# Altium project Smart104.ua_V2_rev2.PrjPcb
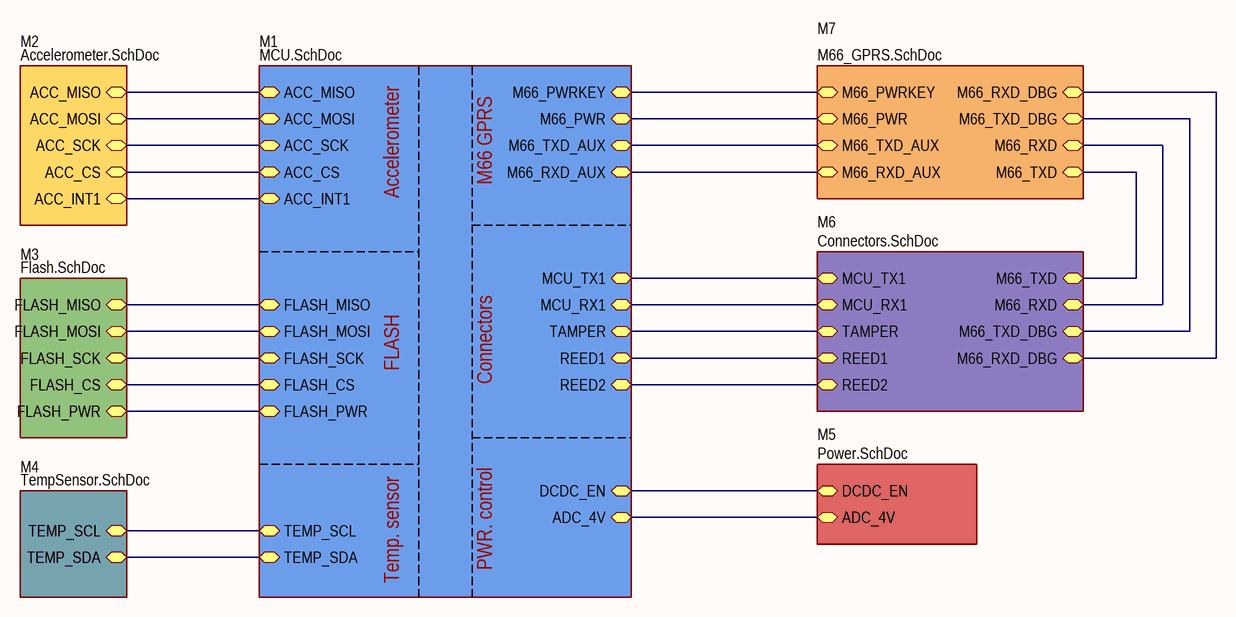
[diagram p0: TopLevelSCH.SchDoc]
8 sheets, 158 parts. Net scope: hierarchical (ports join the sheet entries above them; power ports are global).
Board file: Smart104.ua_V2_rev2.PcbDoc
Sheets:
  TopLevelSCH.SchDoc
    M1 = MCU.SchDoc
    M2 = Accelerometer.SchDoc
    M3 = Flash.SchDoc
    M4 = TempSensor.SchDoc
    M5 = Power.SchDoc
    M6 = Connectors.SchDoc
    M7 = M66_GPRS.SchDoc

## Sheet TopLevelSCH.SchDoc
size 420 x 297 mm

### Sub-sheets
M1 = MCU.SchDoc: DCDC_EN (bidir), REED2 (bidir), REED1 (bidir), MCU_TX1 (bidir), TAMPER (bidir), MCU_RX1 (bidir), TEMP_SDA (bidir), TEMP_SCL (bidir), ACC_INT1 (bidir), ACC_MOSI (bidir), ACC_MISO (bidir), ACC_SCK (bidir), ACC_CS (bidir), FLASH_PWR (bidir), FLASH_CS (bidir), FLASH_SCK (bidir), FLASH_MOSI (bidir), FLASH_MISO (bidir), ADC_4V (bidir), M66_PWRKEY (bidir), M66_PWR (bidir), M66_TXD_AUX (bidir), M66_RXD_AUX (bidir)
M2 = Accelerometer.SchDoc: ACC_INT1 (bidir), ACC_MOSI (bidir), ACC_MISO (bidir), ACC_SCK (bidir), ACC_CS (bidir)
M3 = Flash.SchDoc: FLASH_PWR (bidir), FLASH_CS (bidir), FLASH_SCK (bidir), FLASH_MOSI (bidir), FLASH_MISO (bidir)
M4 = TempSensor.SchDoc: TEMP_SDA (bidir), TEMP_SCL (bidir)
M5 = Power.SchDoc: ADC_4V (bidir), DCDC_EN (bidir)
M6 = Connectors.SchDoc: MCU_TX1 (bidir), MCU_RX1 (bidir), TAMPER (bidir), REED2 (bidir), REED1 (bidir), M66_TXD_DBG (bidir), M66_RXD_DBG (bidir), M66_RXD (bidir), M66_TXD (bidir)
M7 = M66_GPRS.SchDoc: M66_PWRKEY (bidir), M66_PWR (bidir), M66_TXD_DBG (bidir), M66_RXD_DBG (bidir), M66_RXD_AUX (bidir), M66_TXD_AUX (bidir), M66_RXD (bidir), M66_TXD (bidir)

### Nets
NetD1_5: sheet M1/ACC_INT1, sheet M2/ACC_INT1
NetD3_17: sheet M6/M66_RXD, sheet M7/M66_RXD
NetD3_18: sheet M6/M66_TXD, sheet M7/M66_TXD
NetD3_38: sheet M6/M66_RXD_DBG, sheet M7/M66_RXD_DBG
NetD3_39: sheet M6/M66_TXD_DBG, sheet M7/M66_TXD_DBG
NetD5_10: sheet M1/REED1, sheet M6/REED1
NetD5_12: sheet M1/M66_RXD_AUX, sheet M7/M66_RXD_AUX
NetD5_13: sheet M1/M66_TXD_AUX, sheet M7/M66_TXD_AUX
NetD5_14: sheet M1/ACC_CS, sheet M2/ACC_CS
NetD5_15: sheet M1/ACC_SCK, sheet M2/ACC_SCK
NetD5_16: sheet M1/ACC_MISO, sheet M2/ACC_MISO
NetD5_17: sheet M1/ACC_MOSI, sheet M2/ACC_MOSI
NetD5_19: sheet M1/ADC_4V, sheet M5/ADC_4V
NetD5_21: sheet M1/M66_PWRKEY, sheet M7/M66_PWRKEY
NetD5_22: sheet M1/M66_PWR, sheet M7/M66_PWR
NetD5_25: sheet M1/FLASH_CS, sheet M3/FLASH_CS
NetD5_26: sheet M1/FLASH_SCK, sheet M3/FLASH_SCK
NetD5_27: sheet M1/FLASH_MISO, sheet M3/FLASH_MISO
NetD5_28: sheet M1/FLASH_MOSI, sheet M3/FLASH_MOSI
NetD5_29: sheet M1/REED2, sheet M6/REED2
NetD5_30: sheet M1/MCU_TX1, sheet M6/MCU_TX1
NetD5_31: sheet M1/MCU_RX1, sheet M6/MCU_RX1
NetD5_41: sheet M1/TAMPER, sheet M6/TAMPER
NetD5_42: sheet M1/TEMP_SCL, sheet M4/TEMP_SCL
NetD5_43: sheet M1/TEMP_SDA, sheet M4/TEMP_SDA
NetD5_45: sheet M1/FLASH_PWR, sheet M3/FLASH_PWR
NetD5_46: sheet M1/DCDC_EN, sheet M5/DCDC_EN

### Notes on the sheet
- M66 GPRS
- Accelerometer
- FLASH
- Connectors
- Temp. sensor
- PWR. control
- Author
- Manufacturer
- Date
- Page
- Total pages
- Size page
- A3
- Materials

## Sheet MCU.SchDoc
size 420 x 297 mm
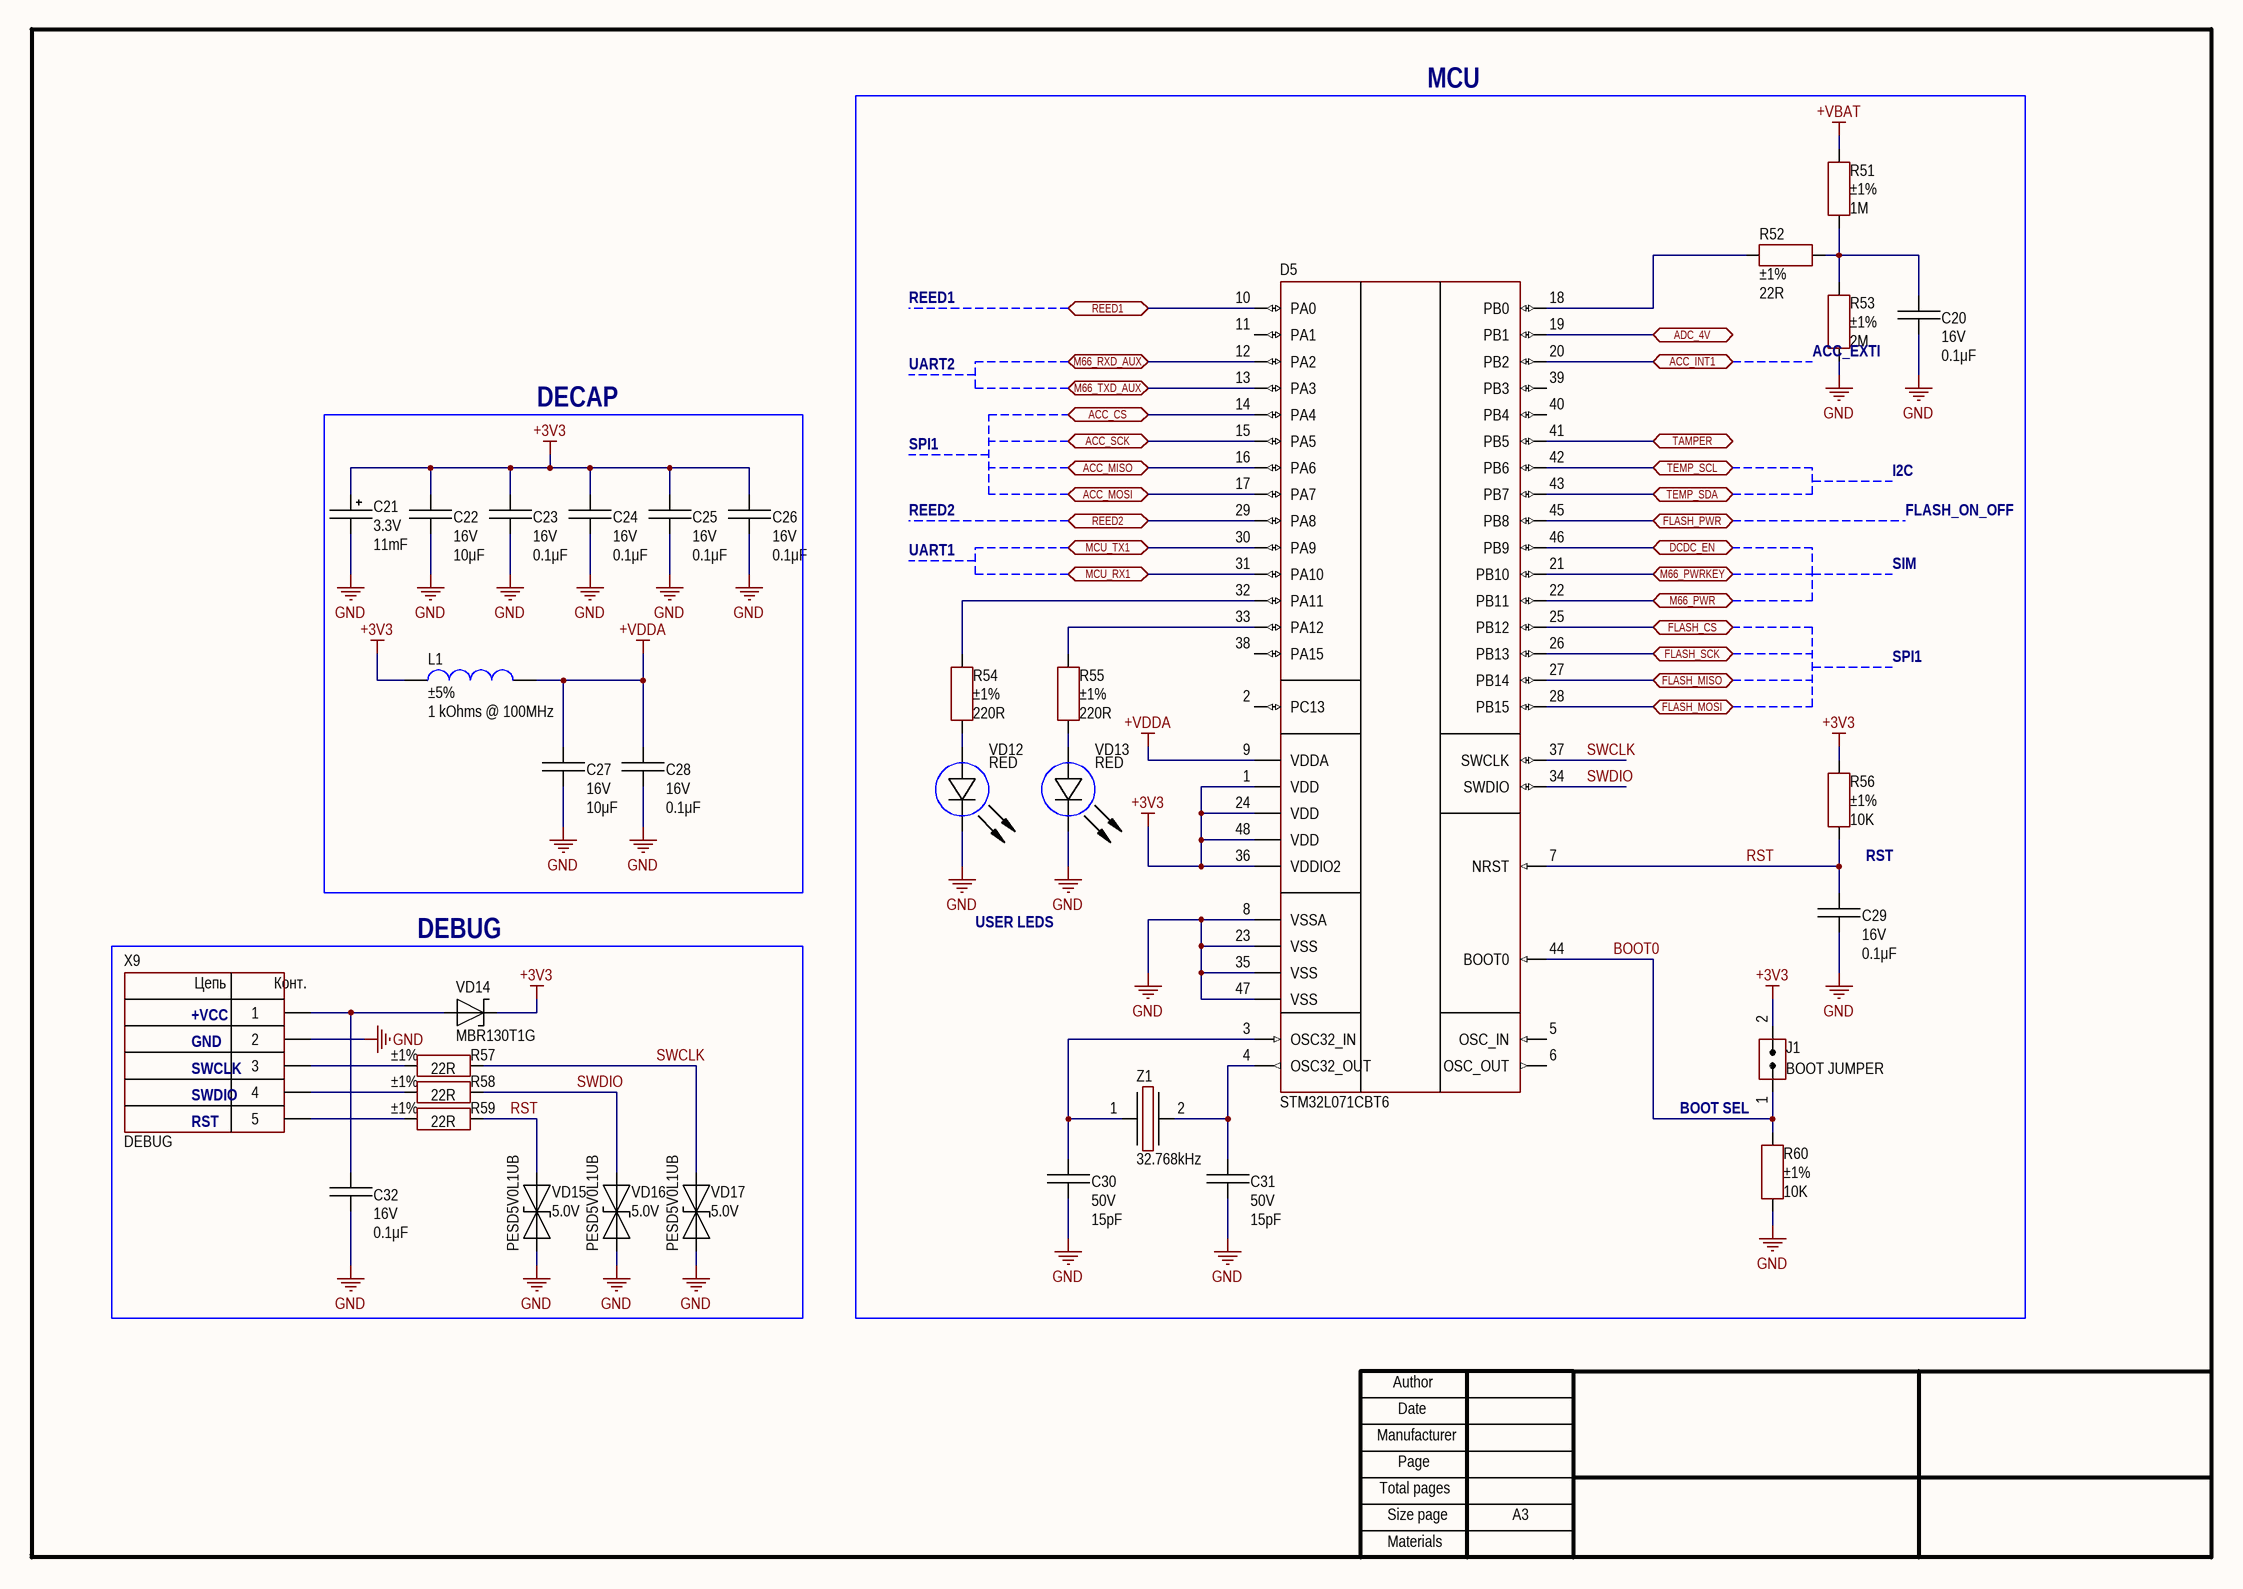
[diagram p1: MCU.SchDoc]

### Parts
C20  value 0.1μF  Voltage: 16V  [CAP: 0402]
C21  value 11mF  Voltage: 3.3V  [CAP: CPH3225A]
C22  value 10μF  Voltage: 16V  [CAP: 0805]
C23  value 0.1μF  Voltage: 16V  [CAP: 0402]
C24  value 0.1μF  Voltage: 16V  [CAP: 0402]
C25  value 0.1μF  Voltage: 16V  [CAP: 0402]
C26  value 0.1μF  Voltage: 16V  [CAP: 0402]
C27  value 10μF  Voltage: 16V  [CAP: 0805]
C28  value 0.1μF  Voltage: 16V  [CAP: 0402]
C29  value 0.1μF  Voltage: 16V  [CAP: 0402]
C30  value 15pF  Voltage: 50V  [CAP: 0402]
C31  value 15pF  Voltage: 50V  [CAP: 0402]
C32  value 0.1μF  Voltage: 16V  [CAP: 0402]
D5  PartNumber: STM32L071CBT6  [48-LQFP]
J1  CommentText: BOOT JUMPER  [CON: JUMPER x1]
L1  value 1 kOhms @ 100MHz  Tolerance: ±5%  [IND: 0402]
R51  value 1M  Tolerance: ±1%  [RES: 0402]
R52  value 22R  Tolerance: ±1%  [RES: 0402]
R53  value 2M  Tolerance: ±1%  [RES: 0402]
R54  value 220R  Tolerance: ±1%  [RES: 0402]
R55  value 220R  Tolerance: ±1%  [RES: 0402]
R56  value 10K  Tolerance: ±1%  [RES: 0402]
R57  value 22R  Tolerance: ±1%  [RES: 0402]
R58  value 22R  Tolerance: ±1%  [RES: 0402]
R59  value 22R  Tolerance: ±1%  [RES: 0402]
R60  value 10K  Tolerance: ±1%  [RES: 0402]
VD12  Color: RED  [LED: 0805R]
VD13  Color: RED  [LED: 0805R]
VD14  PartNumber: MBR130T1G  [DIODE: SOD123]
VD15  Voltage: 5.0V  PartNumber: PESD5V0L1UB  [DIODE: SOD523]
VD16  Voltage: 5.0V  PartNumber: PESD5V0L1UB  [DIODE: SOD523]
VD17  Voltage: 5.0V  PartNumber: PESD5V0L1UB  [DIODE: SOD523]
X9  CommentText: DEBUG  [CON: PLS-5]
Z1  Frequency: 32.768kHz  [OSC: 3215]

### Blocks framed on the sheet
MCU: C20 C29-C31 D5 J1 R51-R56 R60 VD12 VD13 Z1
DECAP: C21-C28 L1
DEBUG: C32 R57-R59 VD14-VD17 X9

### Ports
ACC_CS (bidir), ACC_INT1 (bidir), ACC_MISO (bidir), ACC_MOSI (bidir), ACC_SCK (bidir), ADC_4V (bidir), DCDC_EN (bidir), FLASH_CS (bidir), FLASH_MISO (bidir), FLASH_MOSI (bidir), FLASH_PWR (bidir), FLASH_SCK (bidir), M66_PWR (bidir), M66_PWRKEY (bidir), M66_RXD_AUX (bidir), M66_TXD_AUX (bidir), MCU_RX1 (bidir), MCU_TX1 (bidir), REED1 (bidir), REED2 (bidir), TAMPER (bidir), TEMP_SCL (bidir), TEMP_SDA (bidir)

### Nets
+3V3: C21.1 C22.2 C23.2 C24.2 C25.2 C26.2 D5.1(VDD) D5.24(VDD) D5.36(VDDIO2) D5.48(VDD) J1.2(IN) L1.2 R56.2 VD14.2
+VBAT: R51.2
+VDDA: C27.2 C28.2 D5.9(VDDA) L1.1
GND: C20.1 C21.2 C22.1 C23.1 C24.1 C25.1 C26.1 C27.1 C28.1 C29.1 C30.1 C31.1 C32.1 D5.8(VSSA) D5.23(VSS) D5.35(VSS) D5.47(VSS) R53.1 R60.1 VD12.2(C) VD13.2(C) VD15.1(A) VD16.1(A) VD17.1(A) X9.2
BOOT0: D5.44(BOOT0) J1.1(IN) R60.2
RST: C29.2 D5.7(NRST) R56.1 R59.2 VD15.2(C)
SWCLK: D5.37(SWCLK) R57.2 VD17.2(C)
SWDIO: D5.34(SWDIO) R58.2 VD16.2(C)
NetC20_2: C20.2 R51.1 R52.2 R53.2
NetC30_2: C30.2 D5.3(OSC32_IN) Z1.1
NetC31_2: C31.2 D5.4(OSC32_OUT) Z1.2
NetC32_2: C32.2 VD14.1 X9.1
NetD1_5: D5.20(PB2) ; port ACC_INT1
NetD5_10: D5.10(PA0) ; port REED1
NetD5_12: D5.12(PA2) ; port M66_RXD_AUX
NetD5_13: D5.13(PA3) ; port M66_TXD_AUX
NetD5_14: D5.14(PA4) ; port ACC_CS
NetD5_15: D5.15(PA5) ; port ACC_SCK
NetD5_16: D5.16(PA6) ; port ACC_MISO
NetD5_17: D5.17(PA7) ; port ACC_MOSI
NetD5_18: D5.18(PB0) R52.1
NetD5_19: D5.19(PB1) ; port ADC_4V
NetD5_21: D5.21(PB10) ; port M66_PWRKEY
NetD5_22: D5.22(PB11) ; port M66_PWR
NetD5_25: D5.25(PB12) ; port FLASH_CS
NetD5_26: D5.26(PB13) ; port FLASH_SCK
NetD5_27: D5.27(PB14) ; port FLASH_MISO
NetD5_28: D5.28(PB15) ; port FLASH_MOSI
NetD5_29: D5.29(PA8) ; port REED2
NetD5_30: D5.30(PA9) ; port MCU_TX1
NetD5_31: D5.31(PA10) ; port MCU_RX1
NetD5_32: D5.32(PA11) R54.2
NetD5_33: D5.33(PA12) R55.2
NetD5_41: D5.41(PB5) ; port TAMPER
NetD5_42: D5.42(PB6) ; port TEMP_SCL
NetD5_43: D5.43(PB7) ; port TEMP_SDA
NetD5_45: D5.45(PB8) ; port FLASH_PWR
NetD5_46: D5.46(PB9) ; port DCDC_EN
NetR54_1: R54.1 VD12.1(A)
NetR55_1: R55.1 VD13.1(A)
NetR57_1: R57.1 X9.3
NetR58_1: R58.1 X9.4
NetR59_1: R59.1 X9.5

Not connected (* = marked no-connect by the designer): D5 2(PC13) 5(OSC_IN) 6(OSC_OUT) 11(PA1) 38(PA15) 39(PB3) 40(PB4)

### Notes on the sheet
- REED1
- UART2
- (near R53) ACC_EXTI
- SPI1
- REED2
- I2C
- FLASH_ON_OFF
- UART1
- SIM
- RST
- USER LEDS
- +VCC
- GND
- SWCLK
- SWDIO
- BOOT SEL
- Author
- Manufacturer
- Date
- Page
- Total pages
- Size page
- A3
- Materials
- (in symbol PLS-5) Цепь; Конт.

### Library data of the parts
C20 C23-C26 C28 C29 C32 = Ceramic_0402: ±10% 16V Ceramic Capacitor X7R 0402 (1005 Metric); Manufacturer: Yageo; PartNumber: CC0402KRX7R7BB104; ValueManufacturerPartNumber: Ceramic capacitor, 0.1μF, X7R, ±10%, 16V, 0402, -55...+125°C; Package: 0402; HelpURL: https://www.digikey.com/product-detail/en/yageo/CC0402KRX7R7BB104/311-1338-1-ND/2103122; Temperature: -55...+125°C; TypeCapacitor: Ceramic capacitor; Tolerance: ±10%; TypeDielectric: X7R
C21 = CPH3225A: EDLC; Manufacturer: Seiko Instruments; PartNumber: F930J107KAAAJ6; ValueManufacturerPartNumber: EDLC, 11mF, 3.3V, ±10%, 160Ohm, 1210, -55...+125°C; Impedance: 160Ohm; Tolerance: ±10%; TypeDielectric: X7R; Package: 1210; HelpURL: https://www.digikey.com/en/products/detail/seiko-instruments/CPH3225A/8692444; Temperature: -55...+125°C; TypeCapacitor: EDLC
C22 C27 = Ceramic_0805: ±20% 16V Ceramic Capacitor X7R 0805 (2012 Metric); Manufacturer: Yageo; PartNumber: CC0805MKX7R7BB106; ValueManufacturerPartNumber: Ceramic capacitor, 10μF, X7R, ±10%, 16V, 0805, -55...+125°C; Tolerance: ±10%; Package: 0805; HelpURL: https://www.digikey.com/en/products/detail/yageo/CC0805MKX7R7BB106/7164392; Temperature: -55...+125°C; TypeCapacitor: Ceramic capacitor; TypeDielectric: X7R
C30 C31 = Ceramic_0402: ±5% 50V Ceramic Capacitor C0G, NP0 0402 (1005 Metric); Manufacturer: Yageo; PartNumber: CC0402JRNPO9BN150; ValueManufacturerPartNumber: Ceramic capacitor, 15pF, NP0, ±10%, 50V, 0402, -55...+125°C; Tolerance: ±10%; Package: 0402; HelpURL: https://www.digikey.com/en/products/detail/yageo/CC0402JRNPO9BN150/302751; Temperature: -55...+125°C; TypeCapacitor: Ceramic capacitor; TypeDielectric: NP0
D5 = STM32L071C8T6: ARM® Cortex®-M0+ series Microcontroller IC 32-Bit 32MHz 128KB (128K x 8) FLASH 48-LQFP (7x7); Manufacturer: STMicroelectronics; ValueManufacturerPartNumber: IC microcontroller, 32-Bit, Cortex-M0+, 32MHz, 128KB, 20KB, 1.65V...3.6V, -40...+85°C, 48-LQFP; Supply: 1.65V...3.6V; MemoryRAM: 20KB; CoreProcessor: Cortex-M0+; HelpURL: https://www.digikey.com/en/products/detail/stmicroelectronics/STM32L071CBT6/6166982; Package: 48-LQFP; ComponentType: IC microcontroller; Temperature: -40...+85°C; Speed: 32MHz; CoreSize: 32-Bit; MemoryROM: 128KB
J1 = Jumper_single
L1 = Inductor_0402: 100 nH Unshielded Multilayer Inductor 200 mA 1.25Ohm Max 0402 (1005 Metric); Manufacturer: Murata Electronics; PartNumber: LQG15HSR10J02D; ValueManufacturerPartNumber: Ferrite Bead, 1 kOhms @ 100MHz, ±5%, 0402, 200mA, -55...+125°C; TypeInductor: Ferrite Bead; MaxCurrent: 200mA; Package: 0402; HelpURL: https://www.digikey.com/product-detail/en/murata-electronics-north-america/LQG15HSR10J02D/490-2635-1-ND/662915; Temperature: -55...+125°C
R51 = Resistor_0402: 1 MOhms ±1% 0.063W, 1/16W Chip Resistor 0402 (1005 Metric) Moisture Resistant Thick Film; Manufacturer: Yageo; PartNumber: RC0402FR-071ML; ValueManufacturerPartNumber: Resistor film, 1M, ±1%, 0402, 0.063W, -55...+125°C; TypeResistor: Resistor film; Package: 0402; HelpURL: https://www.digikey.com/en/products/detail/yageo/RC0402FR-071ML/726515; Temperature: -55...+125°C; Power: 0.063W
R52 R57-R59 = Resistor_0402: 22 Ohms ±1% 0.063W, 1/16W Chip Resistor 0402 (1005 Metric) Moisture Resistant Thick Film; Manufacturer: Yageo; PartNumber: RC0402FR-0722RL; ValueManufacturerPartNumber: Resistor film, 22R, ±1%, 0402, 0.063W, -55...+125°C; TypeResistor: Resistor film; Package: 0402; HelpURL: https://www.digikey.com/en/products/detail/yageo/RC0402FR-0722RL/726562; Temperature: -55...+125°C; Power: 0.063W
R53 = Resistor_0402: 2 MOhms ±1% 0.063W, 1/16W Chip Resistor 0402 (1005 Metric) Moisture Resistant Thick Film; Manufacturer: Yageo; PartNumber: RC0402FR-072ML; ValueManufacturerPartNumber: Resistor film, 2M, ±1%, 0402, 0.063W, -55...+125°C; TypeResistor: Resistor film; Package: 0402; HelpURL: https://www.digikey.com/en/products/detail/yageo/RC0402FR-072ML/5917635; Temperature: -55...+125°C; Power: 0.063W
R54 R55 = Resistor_0402: 220 Ohms ±1% 0.063W, 1/16W Chip Resistor 0402 (1005 Metric) Moisture Resistant Thick Film; Manufacturer: Yageo; PartNumber: RC0402FR-07220RL; ValueManufacturerPartNumber: Resistor film, 220R, ±1%, 0402, 0.063W, -55...+125°C; TypeResistor: Resistor film; Package: 0402; HelpURL: https://www.digikey.com/en/products/detail/yageo/RC0402FR-07220RL/726565; Temperature: -55...+125°C; Power: 0.063W
R56 R60 = Resistor_0402: 10 kOhms ±1% 0.063W, 1/16W Chip Resistor 0402 (1005 Metric) Moisture Resistant Thick Film; Manufacturer: Yageo; PartNumber: RC0402FR-0710KL; ValueManufacturerPartNumber: Resistor film, 10K, ±1%, 0402, 0.063W, -55...+125°C; TypeResistor: Resistor film; Package: 0402; HelpURL: https://www.digikey.com/en/products/detail/yageo/RC0402FR-0710KL/726523; Temperature: -55...+125°C; Power: 0.063W
VD12 VD13 = LED_single: Red 625nm LED Indication - Discrete 1.8V 0805 (2012 Metric); Manufacturer: Kingbright; ValueManufacturerPartNumber: LED, RED, 30mA, 1.8V, 0805, -55...+150°C; PartNumber: APT2012LSECK/J3-PRV; Current: 30mA; Package: 0805; HelpURL: https://www.digikey.com/en/products/detail/kingbright/APT2012LSECK-J3-PRV/5177436; Temperature: -55...+150°C; TypeDiode: LED; VoltageDrop: 1.8V; ColorParameter: RED
VD14 = Schottky_single: Diode Schottky 30 V 1A Surface Mount SOD-123; Manufacturer: Diodes Incorporated; ValueManufacturerPartNumber: Schottky diode, 30V, 1A, 0.45V, 15pF, SOD-123, -55...+150°C; TypeDiode: Schottky diode; Voltage: 30V; VoltageDrop: 0.45V; RecoveryTime: 15pF; Package: SOD-123; HelpURL: https://www.digikey.com/en/products/detail/on-semiconductor/MBR130T1G/918582; Temperature: -55...+150°C; Current: 1A
VD15-VD17 = TVS_single: 12V Clamp 3.5A (8/20µs) Ipp Tvs Diode Surface Mount SOD-523; Manufacturer: Nexperia; TypeDiode: ESD TVS diode; Package: SOD-523; HelpURL: https://www.digikey.com/en/products/detail/nexperia-usa-inc/PESD5V0L1UB115/2092297; ValueManufacturerPartNumber: =TypeDiode+', '+Voltage+', '+Current+', '+VoltageDrop+', '+RecoveryTime+', '+Package+', '+Temperature; Temperature: -55...+150°C; Current: 3.5A
X9 = PLS-5: Pin Header 5 pin Straight, 2.54mm Through Hole.; Manufacturer: KLS; ValueManufacturerPartNumber: Connector, 5pin, 2.54mm, 500VAC, 0.1A; PartNumber: KLS1-207-1-05-S; TypeConnector: Connector; VoltageMax: 500VAC; CurrentMax: 0.1A; Multichannel: 5pin; HelpURL: https://www.klselectronic.com/kls1-207-2-54mm-pitch-male-pin-header-connectors; Pitch: 2.54mm
Z1 = Crystal_3215: 3215 ±20ppm Crystal 12.5pF 2-SMD, No Lead; Manufacturer: Epson; PartNumber: FC-135 32.7680KA-A5; ValueManufacturerPartNumber: Crystal, 32.768kHz, 12.5pF, ±20ppm, case 3215, -40...+85°C; Package: case 3215; HelpURL: https://www.digikey.com/product-detail/en/epson/FC-135-32.7680KA-A5/SER4103CT-ND/6188447; Temperature: -40...+85°C; TypeOscilator: Crystal; LoadCapacitance: 12.5pF; Tolerance: ±20ppm

## Sheet Accelerometer.SchDoc
size 420 x 297 mm
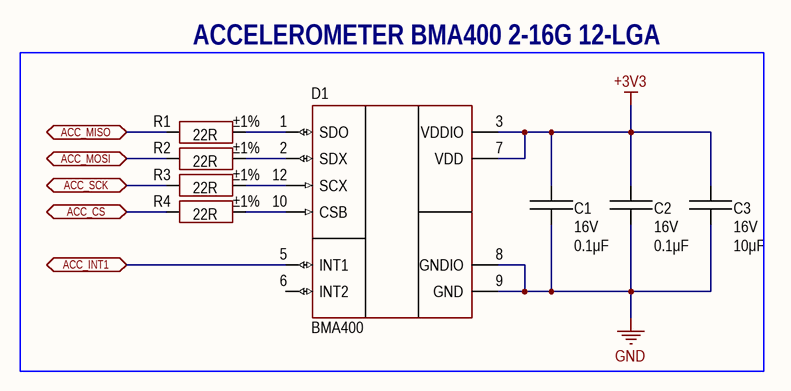
[diagram p2: Accelerometer.SchDoc]

### Parts
C1  value 0.1μF  Voltage: 16V  [CAP: 0402]
C2  value 0.1μF  Voltage: 16V  [CAP: 0402]
C3  value 10μF  Voltage: 16V  [CAP: 0805]
D1  (no value)  [12-VFLGA]
R1  value 22R  Tolerance: ±1%  [RES: 0402]
R2  value 22R  Tolerance: ±1%  [RES: 0402]
R3  value 22R  Tolerance: ±1%  [RES: 0402]
R4  value 22R  Tolerance: ±1%  [RES: 0402]

### Blocks framed on the sheet
ACCELEROMETER BMA400 2-16G 12-LGA: C1-C3 D1 R1-R4

### Ports
ACC_CS (bidir), ACC_INT1 (bidir), ACC_MISO (bidir), ACC_MOSI (bidir), ACC_SCK (bidir)

### Nets
+3V3: C1.2 C2.2 C3.2 D1.3(VDDIO) D1.7(VDD)
GND: C1.1 C2.1 C3.1 D1.8(GNDIO) D1.9(GND)
NetD1_1: D1.1(SDO) R1.2
NetD1_2: D1.2(SDX) R2.2
NetD1_5: D1.5(INT1) ; port ACC_INT1
NetD1_10: D1.10(CSB) R4.2
NetD1_12: D1.12(SCX) R3.2
NetD5_14: R4.1 ; port ACC_CS
NetD5_15: R3.1 ; port ACC_SCK
NetD5_16: R1.1 ; port ACC_MISO
NetD5_17: R2.1 ; port ACC_MOSI

Not connected (* = marked no-connect by the designer): D1 6(INT2)

### Notes on the sheet
- Author
- Manufacturer
- Date
- Page
- Total pages
- Size page
- A3
- Materials

### Library data of the parts
C1 C2 = Ceramic_0402: as C20 on sheet MCU; Package: 0402; HelpURL: https://www.digikey.com/product-detail/en/yageo/CC0402KRX7R7BB104/311-1338-1-ND/2103122; Temperature: -55...+125°C; TypeCapacitor: Ceramic capacitor; Tolerance: ±10%; TypeDielectric: X7R
C3 = Ceramic_0805: as C22 on sheet MCU; Package: 0805; HelpURL: https://www.digikey.com/en/products/detail/yageo/CC0805MKX7R7BB106/7164392; Temperature: -55...+125°C; TypeCapacitor: Ceramic capacitor; TypeDielectric: X7R
D1 = BMA400: Accelerometer X, Y, Z Axis ±2g, 4g, 8g, 16g - 12-LGA (2x2); Manufacturer: Bosch Sensortec; Supply: 1.72...3.6V; Sensing: Digital sensor; HelpURL: https://www.digikey.com/en/products/detail/bosch-sensortec/BMA400/8634941; Package: 12-VFLGA; ComponentType: IC accelerometer; ValueManufacturerPartNumber: =ComponentType+', '+Sensing+', '+Accuracy+', '+GainBandwidth+', '+Sensitivity+', '+Temperature+', '+Package; Temperature: -40...+85°C; PartNumber: BMA400
R1-R4 = Resistor_0402: as R52 on sheet MCU; Package: 0402; HelpURL: https://www.digikey.com/en/products/detail/yageo/RC0402FR-0722RL/726562; Temperature: -55...+125°C; Power: 0.063W

## Sheet Flash.SchDoc
size 420 x 297 mm
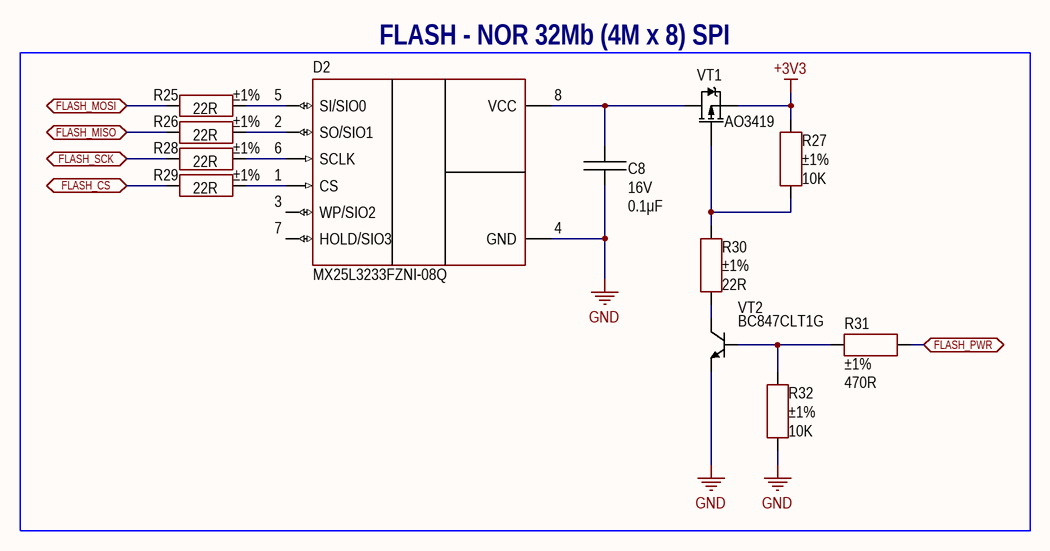
[diagram p3: Flash.SchDoc]

### Parts
C8  value 0.1μF  Voltage: 16V  [CAP: 0402]
D2  PartNumber: MX25L3233FZNI-08Q  [8-SOIC]
R25  value 22R  Tolerance: ±1%  [RES: 0402]
R26  value 22R  Tolerance: ±1%  [RES: 0402]
R27  value 10K  Tolerance: ±1%  [RES: 0402]
R28  value 22R  Tolerance: ±1%  [RES: 0402]
R29  value 22R  Tolerance: ±1%  [RES: 0402]
R30  value 22R  Tolerance: ±1%  [RES: 0402]
R31  value 470R  Tolerance: ±1%  [RES: 0402]
R32  value 10K  Tolerance: ±1%  [RES: 0402]
VT1  PartNumber: AO3419  [SOT23]
VT2  PartNumber: BC847CLT1G  [SOT23]

### Blocks framed on the sheet
FLASH - NOR 32Mb (4M x 8) SPI: C8 D2 R25-R32 VT1 VT2

### Ports
FLASH_CS (bidir), FLASH_MISO (bidir), FLASH_MOSI (bidir), FLASH_PWR (bidir), FLASH_SCK (bidir)

### Nets
+3V3: R27.2 VT1.2(S)
GND: C8.1 D2.4(GND) R32.1 VT2.2(E)
NetC8_2: C8.2 D2.8(VCC) VT1.3(D)
NetD2_1: D2.1(CS) R29.2
NetD2_2: D2.2(SO/SIO1) R26.2
NetD2_5: D2.5(SI/SIO0) R25.2
NetD2_6: D2.6(SCLK) R28.2
NetD5_25: R29.1 ; port FLASH_CS
NetD5_26: R28.1 ; port FLASH_SCK
NetD5_27: R26.1 ; port FLASH_MISO
NetD5_28: R25.1 ; port FLASH_MOSI
NetD5_45: R31.2 ; port FLASH_PWR
NetR27_1: R27.1 R30.2 VT1.1(G)
NetR30_1: R30.1 VT2.3(C)
NetR31_1: R31.1 R32.2 VT2.1(B)

Not connected (* = marked no-connect by the designer): D2 3(WP/SIO2) 7(HOLD/SIO3)

### Notes on the sheet
- Author
- Manufacturer
- Date
- Page
- Total pages
- Size page
- A3
- Materials

### Library data of the parts
C8 = Ceramic_0402: as C20 on sheet MCU; Package: 0402; HelpURL: https://www.digikey.com/product-detail/en/yageo/CC0402KRX7R7BB104/311-1338-1-ND/2103122; Temperature: -55...+125°C; TypeCapacitor: Ceramic capacitor; Tolerance: ±10%; TypeDielectric: X7R
D2 = MX25L3233: FLASH - NOR Memory IC 32Mb (8M x 4) SPI - Quad I/O 133 MHz 8-SOP; Manufacturer: Macronix; ValueManufacturerPartNumber: IC memory, FLASH, 32Mb (8M x 4), 133 MHz, SPI/QuadSPI, 2.7...3.6V, -40...+85°C, 8-SOIC; Supply: 2.7...3.6V; Speed: 133 MHz; InterfaceData: SPI/QuadSPI; HelpURL: https://www.digikey.com/en/products/detail/macronix/MX25L3233FM2I-08Q/7402342; Package: 8-SOIC; ComponentType: IC memory; Temperature: -40...+85°C; MemorySize: 32Mb (8M x 4); MemoryType: FLASH
R25 R26 R28-R30 = Resistor_0402: as R52 on sheet MCU; Package: 0402; HelpURL: https://www.digikey.com/en/products/detail/yageo/RC0402FR-0722RL/726562; Temperature: -55...+125°C; Power: 0.063W
R27 R32 = Resistor_0402: as R56 on sheet MCU; Package: 0402; HelpURL: https://www.digikey.com/en/products/detail/yageo/RC0402FR-0710KL/726523; Temperature: -55...+125°C; Power: 0.063W
R31 = Resistor_0402: 470 Ohms ±1% 0.063W, 1/16W Chip Resistor 0402 (1005 Metric) Moisture Resistant Thick Film; Manufacturer: Yageo; PartNumber: RC0402FR-07470RL; ValueManufacturerPartNumber: Resistor film, 470R, ±1%, 0402, 0.063W, -55...+125°C; TypeResistor: Resistor film; Package: 0402; HelpURL: https://www.digikey.com/en/products/detail/yageo/RC0402FR-07470RL/726619; Temperature: -55...+125°C; Power: 0.063W
VT1 = MOSFET_P_132: P-Channel 20 V 3.5A (Ta) 1.4W (Ta) Surface Mount SOT-23-3; Manufacturer: Alpha & Omega Semiconductor; ValueManufacturerPartNumber: MOSFET P-channel transistor, 20V, 3.5A, 4.4nC, 2.5W, 85mOhm, 400pF, SOT-23-3, -55...+150°C; TypeTransistor: MOSFET P-channel transistor; VoltageDS: 20V; RDS: 85mOhm; GateCharge: 4.4nC; InputCapacitor: 400pF; MaxPower: 2.5W; Package: SOT-23-3; HelpURL: https://www.digikey.com/product-detail/en/infineon-technologies/BSC340N08NS3GATMA1/BSC340N08NS3GATMA1TR-ND/2080655; Temperature: -55...+150°C; CurrentDS: 3.5A
VT2 = BJT_NPN_132: Bipolar (BJT) Transistor NPN 45 V 100 mA 100MHz 300 mW Surface Mount SOT-23-3 (TO-236); Manufacturer: ON Semiconductor; ValueManufacturerPartNumber: NPN transistor, 45V, 100mA, 100MHz, 300mW, 0.6V, 420, SOT-23, -55...+125°C; TypeTransistor: NPN transistor; VoltageCE: 45V; CurrentCE: 100mA; VoltageSaturation: 0.6V; CurrentGain: 420; MaxPower: 300mW; Package: SOT-23; HelpURL: https://www.digikey.com/product-detail/en/on-semiconductor/BC847CLT1G/BC847CLT1GOSCT-ND/917836; Temperature: -55...+125°C; Frequency: 100MHz

## Sheet TempSensor.SchDoc
size 420 x 297 mm
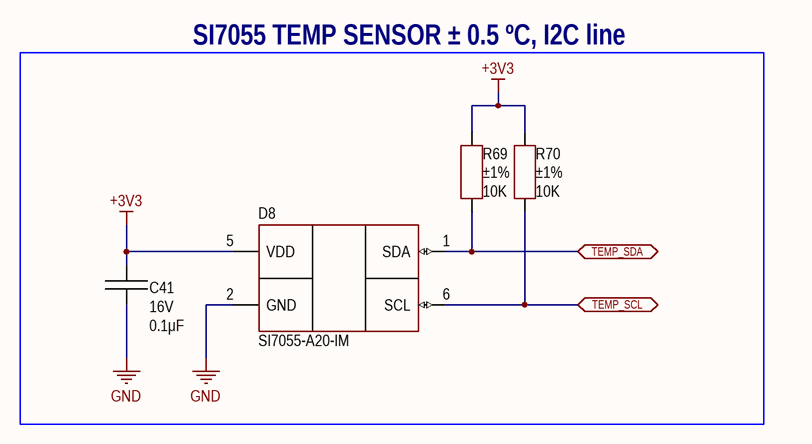
[diagram p4: TempSensor.SchDoc]

### Parts
C41  value 0.1μF  Voltage: 16V  [CAP: 0402]
D8  (no value)  [6-WDFN(3x3)]
R69  value 10K  Tolerance: ±1%  [RES: 0402]
R70  value 10K  Tolerance: ±1%  [RES: 0402]

### Blocks framed on the sheet
SI7055 TEMP SENSOR ± 0.5 ºC, I2C line: C41 D8 R69 R70

### Ports
TEMP_SCL (bidir), TEMP_SDA (bidir)

### Nets
+3V3: C41.2 D8.5(VDD) R69.2 R70.2
GND: C41.1 D8.2(GND)
NetD5_42: D8.6(SCL) R70.1 ; port TEMP_SCL
NetD5_43: D8.1(SDA) R69.1 ; port TEMP_SDA

### Notes on the sheet
- Author
- Manufacturer
- Date
- Page
- Total pages
- Size page
- A3
- Materials

### Library data of the parts
C41 = Ceramic_0402: as C20 on sheet MCU; Package: 0402; HelpURL: https://www.digikey.com/product-detail/en/yageo/CC0402KRX7R7BB104/311-1338-1-ND/2103122; Temperature: -55...+125°C; TypeCapacitor: Ceramic capacitor; Tolerance: ±10%; TypeDielectric: X7R
D8 = SI7055-A20-IM: Temperature sensor; Manufacturer: Silicon Labs; Supply: 1.9...3.6V; Accuracy: ±0.5°C; Sensing: Digital sensor; HelpURL: https://www.digikey.com/en/products/detail/silicon-labs/SI7055-A20-IM/5025891; Package: 6-WDFN; ComponentType: IC temperature sensor; ValueManufacturerPartNumber: =ComponentType+', '+Sensing+', '+Accuracy+', '+GainBandwidth+', '+Sensitivity+', '+Temperature+', '+Package; Temperature: -40...+125°C; PartNumber: SI7055-A20-IM
R69 R70 = Resistor_0402: as R56 on sheet MCU; Package: 0402; HelpURL: https://www.digikey.com/en/products/detail/yageo/RC0402FR-0710KL/726523; Temperature: -55...+125°C; Power: 0.063W

## Sheet Power.SchDoc
size 420 x 297 mm
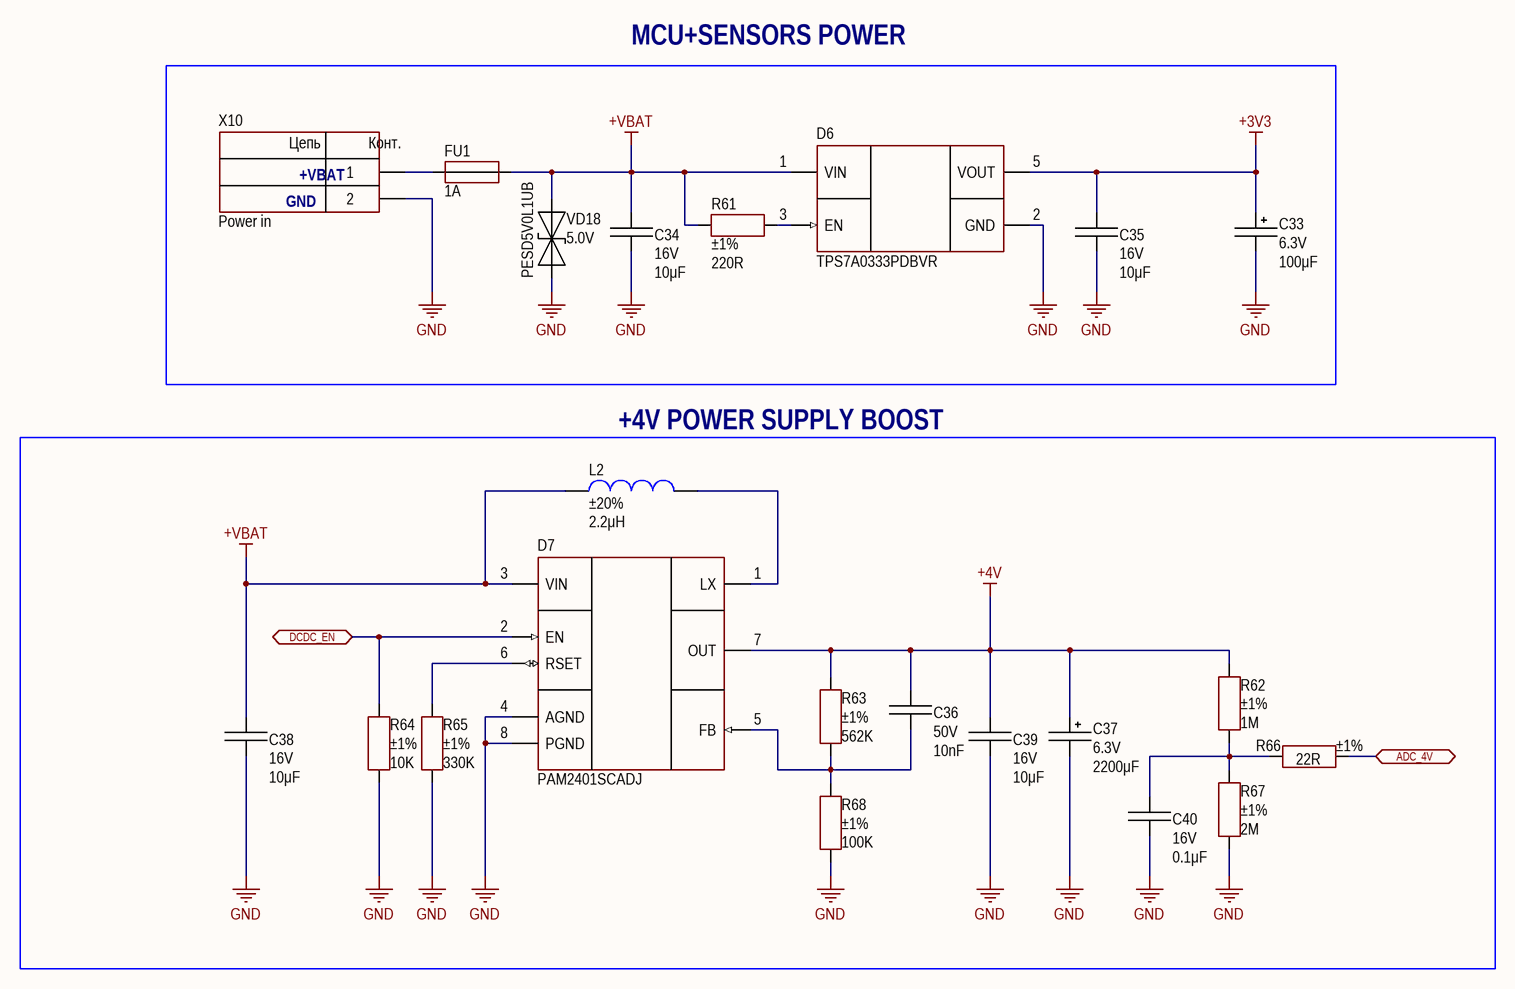
[diagram p5: Power.SchDoc]

### Parts
C33  value 100μF  Voltage: 6.3V  [CAP: TANTAL-A]
C34  value 10μF  Voltage: 16V  [CAP: 0805]
C35  value 10μF  Voltage: 16V  [CAP: 0805]
C36  value 10nF  Voltage: 50V  [CAP: 0402]
C37  value 2200μF  Voltage: 6.3V  [CAP: D10C5H12.5]
C38  value 10μF  Voltage: 16V  [CAP: 0805]
C39  value 10μF  Voltage: 16V  [CAP: 0805]
C40  value 0.1μF  Voltage: 16V  [CAP: 0402]
D6  PartNumber: TPS7A0333PDBVR  [SOT23-5]
D7  (no value)  [8-TSSOP]
FU1  MaxCurrent: 1A  [FUSE: 1206]
L2  value 2.2μH  Tolerance: ±20%  [IND: 1008 (2520)]
R61  value 220R  Tolerance: ±1%  [RES: 0402]
R62  value 1M  Tolerance: ±1%  [RES: 0402]
R63  value 562K  Tolerance: ±1%  [RES: 0402]
R64  value 10K  Tolerance: ±1%  [RES: 0402]
R65  value 330K  Tolerance: ±1%  [RES: 0402]
R66  value 22R  Tolerance: ±1%  [RES: 0402]
R67  value 2M  Tolerance: ±1%  [RES: 0402]
R68  value 100K  Tolerance: ±1%  [RES: 0402]
VD18  Voltage: 5.0V  PartNumber: PESD5V0L1UB  [DIODE: SOD523]
X10  CommentText: Power in  [CON: 282834-2]

### Blocks framed on the sheet
MCU+SENSORS POWER: C33-C35 D6 FU1 R61 VD18 X10
+4V POWER SUPPLY BOOST: C36-C40 D7 L2 R62-R68

### Ports
ADC_4V (bidir), DCDC_EN (bidir)

### Nets
+3V3: C33.1 C35.2 D6.5(VOUT)
+4V: C36.2 C37.1 C39.2 D7.7(OUT) R62.2 R63.2
+VBAT: C34.2 C38.2 D6.1(VIN) D7.3(VIN) FU1.2 L2.2 R61.2 VD18.2(C)
GND: C33.2 C34.1 C35.1 C37.2 C38.1 C39.1 C40.1 D6.2(GND) D7.4(AGND) D7.8(PGND) R64.1 R65.1 R67.1 R68.1 VD18.1(A) X10.2
NetC36_1: C36.1 D7.5(FB) R63.1 R68.2
NetC40_2: C40.2 R62.1 R66.1 R67.2
NetD5_19: R66.2 ; port ADC_4V
NetD5_46: D7.2(EN) R64.2 ; port DCDC_EN
NetD6_3: D6.3(EN) R61.1
NetD7_1: D7.1(LX) L2.1
NetD7_6: D7.6(RSET) R65.2
NetFU1_1: FU1.1 X10.1

### Notes on the sheet
- GND
- +VBAT
- Author
- Manufacturer
- Date
- Page
- Total pages
- Size page
- A3
- Materials
- (in symbol KLS2-308V-2.54-02P-4S) Цепь; Конт.

### Library data of the parts
C33 = Tantal_A: 100 µF Molded Tantalum Polymer Capacitor 6.3 V 1206 (3216 Metric) 100mOhm @ 100kHz; Manufacturer: AVX; PartNumber: TCJA107M006R0100; ValueManufacturerPartNumber: Tantalum capacitor, 100μF, 6.3V, ±10%, 0.1Ohm, case A (3216), -55...+125°C; Impedance: 0.1Ohm; Tolerance: ±10%; TypeCapacitor: Tantalum capacitor; Package: case A (3216); HelpURL: https://www.digikey.com/en/products/detail/avx-corporation/TCJA107M006R0100/4990371; Temperature: -55...+125°C; TypeDielectric: Polymer
C34 C35 C38 C39 = Ceramic_0805: as C22 on sheet MCU; Package: 0805; HelpURL: https://www.digikey.com/en/products/detail/yageo/CC0805MKX7R7BB106/7164392; Temperature: -55...+125°C; TypeCapacitor: Ceramic capacitor; TypeDielectric: X7R
C36 = Ceramic_0402: 10000 pF ±10% 50V Ceramic Capacitor X7R 0402 (1005 Metric); Manufacturer: Yageo; PartNumber: CC0402KRX7R9BB103; ValueManufacturerPartNumber: Ceramic capacitor, 10nF, X7R, ±10%, 50V, 0402, -55...+125°C; Package: 0402; HelpURL: https://www.digikey.com/en/products/detail/yageo/CC0402KRX7R9BB103/2103087; Temperature: -55...+125°C; TypeCapacitor: Ceramic capacitor; Tolerance: ±10%; TypeDielectric: X7R
C37 = Aluminium: 2200 µF 6.3 V Aluminum - Polymer Capacitors Radial, Can 13mOhm 2000 Hrs @ 125°C; Manufacturer: KEMET; PartNumber: A759MS228M0JAAE013; ValueManufacturerPartNumber: Aluminium capacitor, 2200μF, 6.3V, ±20%, 13mOhm, 10x12x5 mm, -55...+105°C; TypeCapacitor: Aluminium capacitor; Tolerance: ±20%; Package: 10x12x5 mm; HelpURL: https://www.digikey.com/en/products/detail/kemet/A759MS228M0JAAE013/13420067; Temperature: -55...+105°C; Impedance: 13mOhm
C40 = Ceramic_0402: as C20 on sheet MCU; Package: 0402; HelpURL: https://www.digikey.com/product-detail/en/yageo/CC0402KRX7R7BB104/311-1338-1-ND/2103122; Temperature: -55...+125°C; TypeCapacitor: Ceramic capacitor; Tolerance: ±10%; TypeDielectric: X7R
D6 = AP2204K-3.3TRG1: Linear Voltage Regulator IC Positive Fixed 1 Output 3.3V 200mA SOT-23-5; Manufacturer: Texas Instruments; ValueManufacturerPartNumber: Linear voltage regulator, input 3.2...6V, 0.27V, output 3.3V, 0.2A, -40...+85°C, SOT23-6; VoltageInput: input 3.2...6V; MaxDropout: 0.27V; CurrentOutput: 0.2A; HelpURL: https://www.digikey.com/en/products/detail/texas-instruments/TPS7A0333PDBVR/12165108; Package: SOT23-6; ComponentType: Linear voltage regulator; Temperature: -40...+85°C; VoltageOutput: output 3.3V
D7 = PAM2401SCADJ: Boost Switching Regulator IC Positive Adjustable 2.5V 1 Output 1A 8-TSSOP, 8-MSOP (0.118", 3.00mm Width); Manufacturer: Diodes Incorporated; ValueManufacturerPartNumber: DC/DC boost converter, input 0.9...4.75V, 1MHz, output 2.5..5V, 1A, -40...+125°C, TO-263-5; VoltageInput: input 0.9...4.75V; Frequency: 1MHz; VoltageOutput: output 2.5..5V; HelpURL: https://www.digikey.com/en/products/detail/diodes-incorporated/PAM2401SCADJ/4898817; Package: TO-263-5; ComponentType: DC/DC boost converter; Temperature: -40...+125°C; CurrentOutput: 1A; Parameter 1: DC/DC boost converter, input 0.9...4.75V, 1MHz, output 2.5..5V, 1A, -40...+125°C, TO-263-5; PartNumber: PAM2401SCADJ
FU1 = Fuse: Polymeric PTC Resettable Fuse 6V 1 A Ih Surface Mount 1206 (3216 Metric), Concave; Manufacturer: Bel Fuse Inc.; PartNumber: 0ZCJ0100FF2E; TypeFuse: Electromechanics relay; Package: 1206; HelpURL: https://www.digikey.com/en/products/detail/bel-fuse-inc/0ZCJ0100FF2E/4156136; ValueManufacturerPartNumber: =TypeFuse+', '+VoltageMax+', '+MaxCurrent+', '+Package+', '+Temperature; VoltageMax: 6V
L2 = Inductor_1008 (2520): 2.2 µH Shielded Multilayer Inductor 1.3 A 80mOhm Max 1008 (2520 Metric); Manufacturer: Bourns; PartNumber: CVH252009-2R2M; ValueManufacturerPartNumber: Fixed inductor, 2.2μH, ±20%, 1008, 1.3A, -40...+150°C; TypeInductor: Fixed inductor; MaxCurrent: 1.3A; Package: 1008; HelpURL: https://www.digikey.com/en/products/detail/bourns-inc/CVH252009-2R2M/3440072; Temperature: -40...+150°C
R61 = Resistor_0402: as R54 on sheet MCU; Package: 0402; HelpURL: https://www.digikey.com/en/products/detail/yageo/RC0402FR-07220RL/726565; Temperature: -55...+125°C; Power: 0.063W
R62 = Resistor_0402: as R51 on sheet MCU; Package: 0402; HelpURL: https://www.digikey.com/en/products/detail/yageo/RC0402FR-071ML/726515; Temperature: -55...+125°C; Power: 0.063W
R63 = Resistor_0402: 562 kOhms ±1% 0.063W, 1/16W Chip Resistor 0402 (1005 Metric) Moisture Resistant Thick Film; Manufacturer: Yageo; PartNumber: RC0402FR-07562KL; ValueManufacturerPartNumber: Resistor film, 562K, ±1%, 0402, 0.063W, -55...+125°C; TypeResistor: Resistor film; Package: 0402; HelpURL: https://www.digikey.com/en/products/detail/yageo/RC0402FR-07562KL/726639; Temperature: -55...+125°C; Power: 0.063W
R64 = Resistor_0402: as R56 on sheet MCU; Package: 0402; HelpURL: https://www.digikey.com/en/products/detail/yageo/RC0402FR-0710KL/726523; Temperature: -55...+125°C; Power: 0.063W
R65 = Resistor_0402: 330 kOhms ±1% 0.063W, 1/16W Chip Resistor 0402 (1005 Metric) Moisture Resistant Thick Film; Manufacturer: Yageo; PartNumber: RC0402FR-07330KL; ValueManufacturerPartNumber: Resistor film, 330K, ±1%, 0402, 0.063W, -55...+125°C; TypeResistor: Resistor film; Package: 0402; HelpURL: https://www.digikey.com/en/products/detail/yageo/RC0402FR-07330KL/2827574; Temperature: -55...+125°C; Power: 0.063W
R66 = Resistor_0402: as R52 on sheet MCU; Package: 0402; HelpURL: https://www.digikey.com/en/products/detail/yageo/RC0402FR-0722RL/726562; Temperature: -55...+125°C; Power: 0.063W
R67 = Resistor_0402: as R53 on sheet MCU; Package: 0402; HelpURL: https://www.digikey.com/en/products/detail/yageo/RC0402FR-072ML/5917635; Temperature: -55...+125°C; Power: 0.063W
R68 = Resistor_0402: 100 kOhms ±1% 0.063W, 1/16W Chip Resistor 0402 (1005 Metric) Moisture Resistant Thick Film; Manufacturer: Yageo; PartNumber: RC0402FR-07100KL; ValueManufacturerPartNumber: Resistor film, 100K, ±1%, 0402, 0.063W, -55...+125°C; TypeResistor: Resistor film; Package: 0402; HelpURL: https://www.digikey.com/en/products/detail/yageo/RC0402FR-07100KL/726526; Temperature: -55...+125°C; Power: 0.063W
VD18 = TVS_single: as VD15 on sheet MCU; Package: SOD-523; HelpURL: https://www.digikey.com/en/products/detail/nexperia-usa-inc/PESD5V0L1UB115/2092297; ValueManufacturerPartNumber: =TypeDiode+', '+Voltage+', '+Current+', '+VoltageDrop+', '+RecoveryTime+', '+Package+', '+Temperature; Temperature: -55...+150°C; Current: 3.5A
X10 = KLS2-308V-2.54-02P-4S: 2 Position Wire to Board Terminal Block Horizontal with Board 0.100" (2.54mm) Through Hole; Manufacturer: KLS; TypeConnector: Block Terminal; VoltageMax: 500VAC; CurrentMax: 15A; Multichannel: 2pin; HelpURL: http://www.klsele.com/products/Terminal-blocks/560/278.html; ValueManufacturerPartNumber: =TypeConnector+', '+Multichannel+', '+Pitch+', '+VoltageMax+', '+CurrentMax; PartNumber: KLS2-308V-2.54-02P-4S

## Sheet Connectors.SchDoc
size 420 x 297 mm
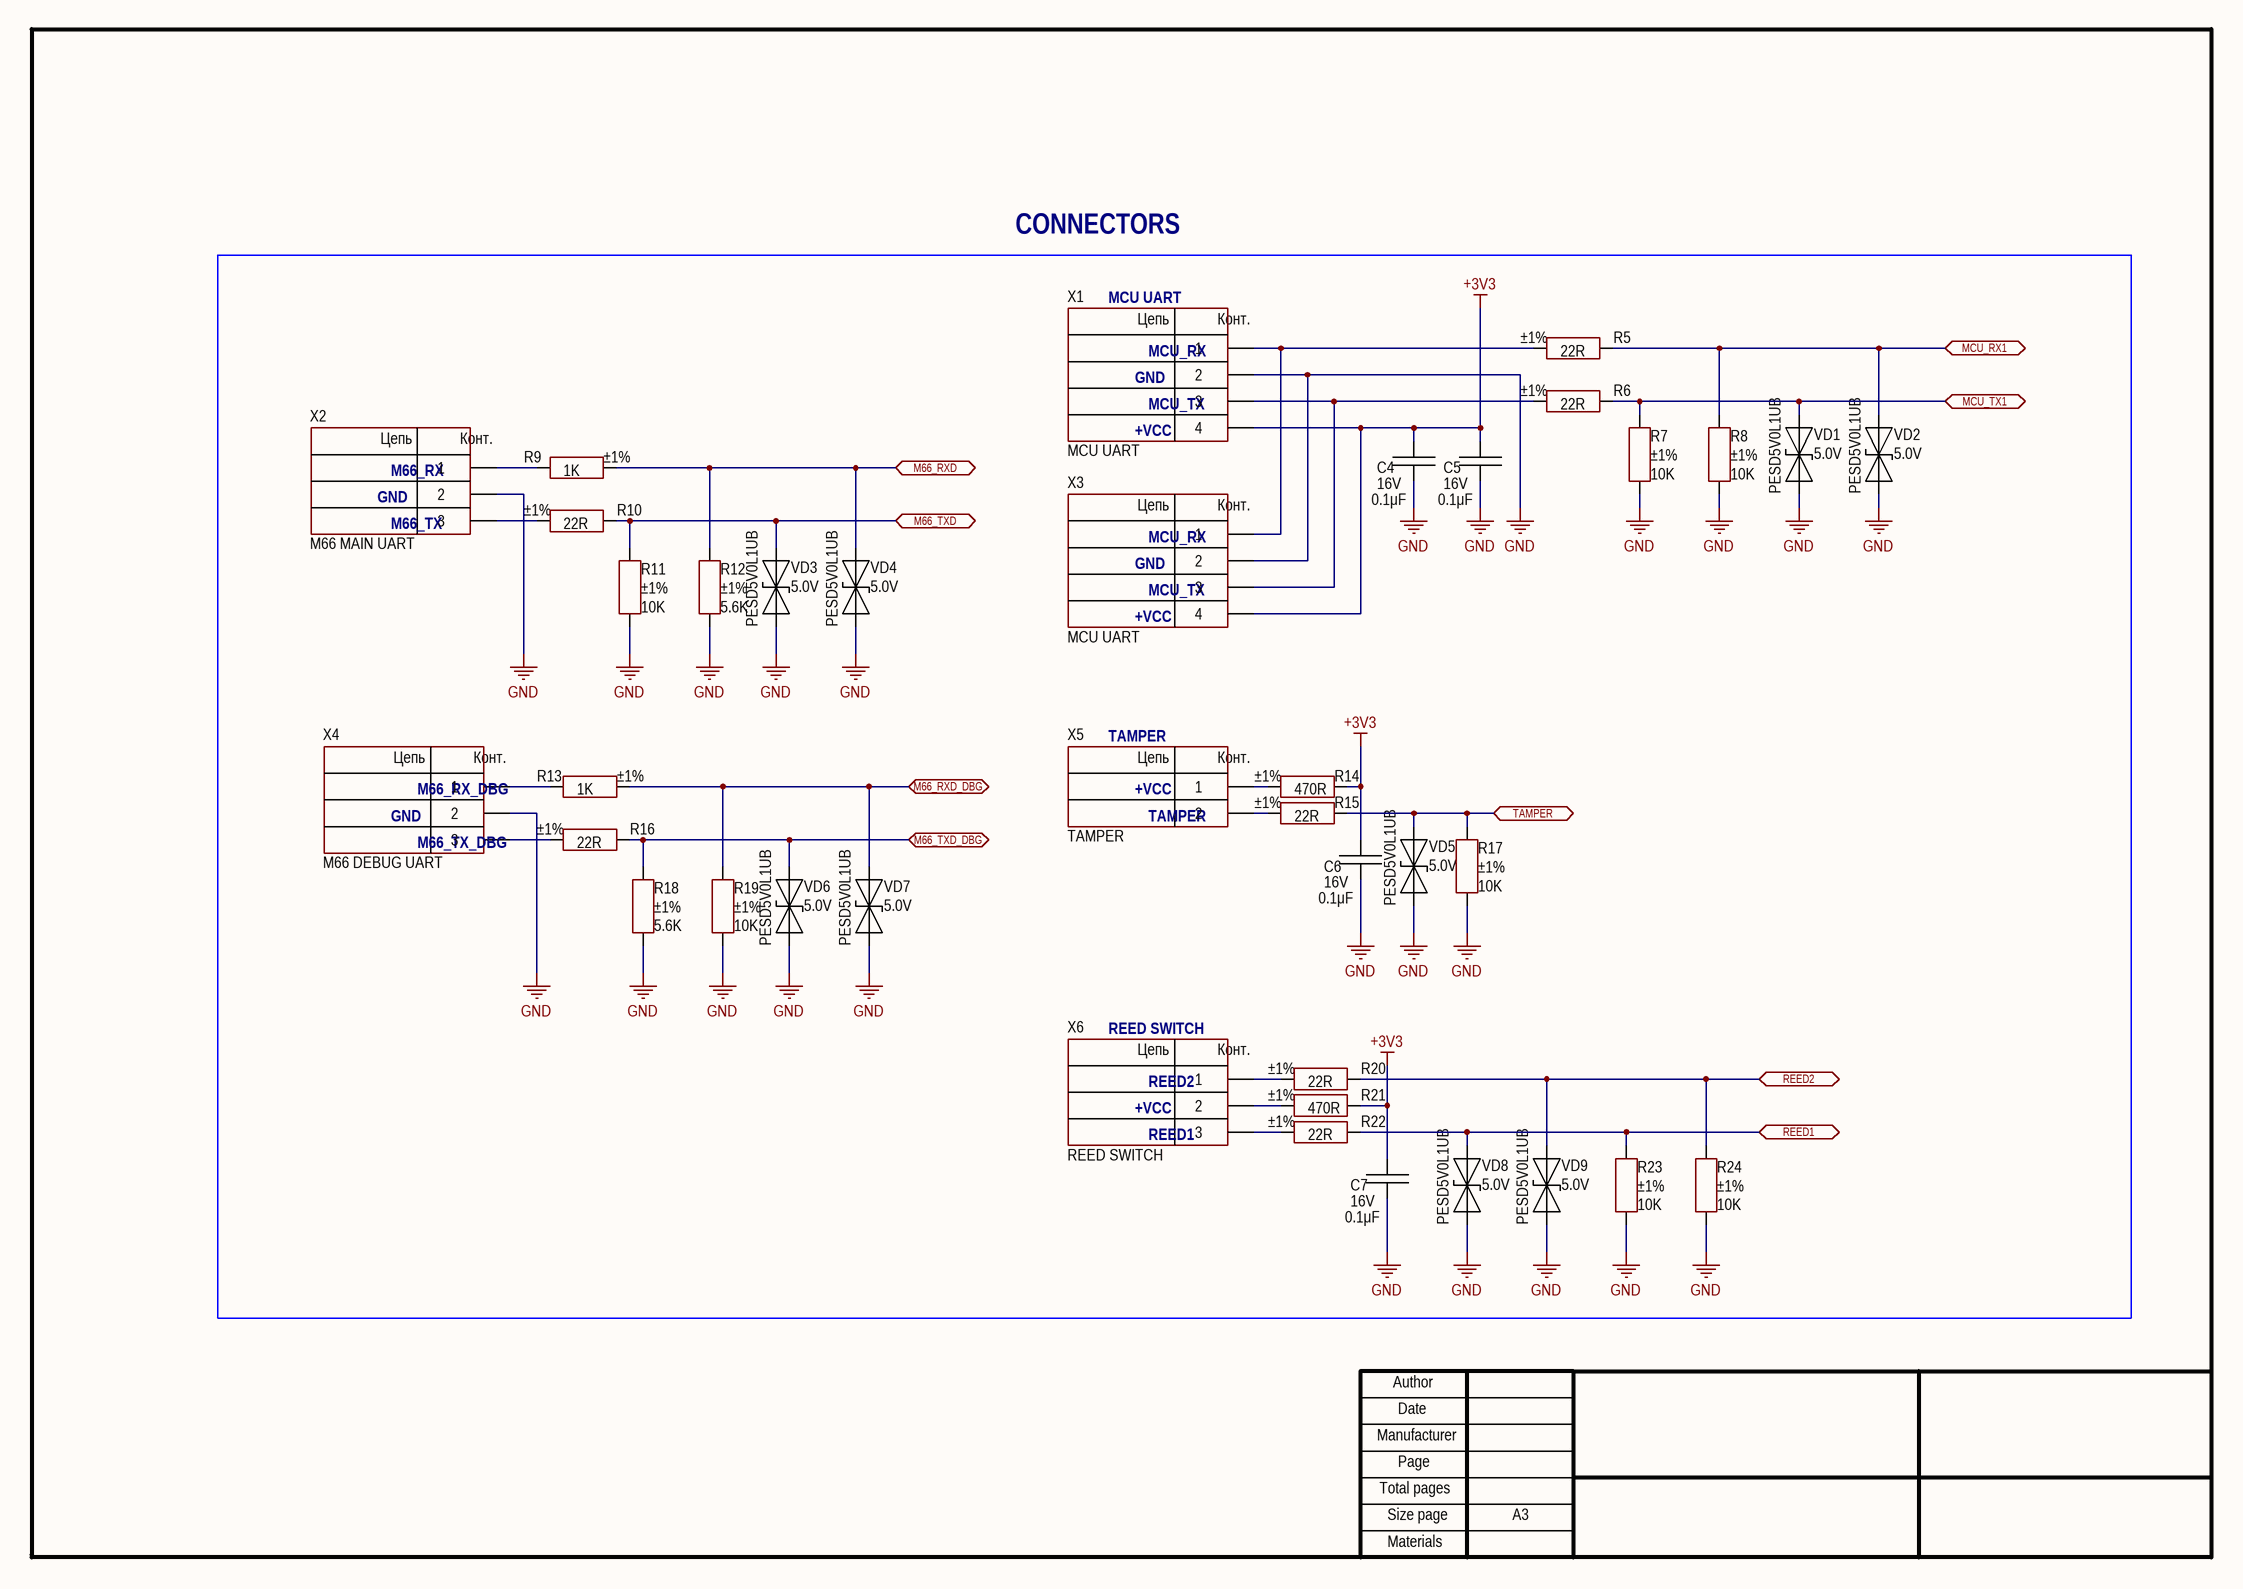
[diagram p6: Connectors.SchDoc]

### Parts
C4  value 0.1μF  Voltage: 16V  [CAP: 0402]
C5  value 0.1μF  Voltage: 16V  [CAP: 0402]
C6  value 0.1μF  Voltage: 16V  [CAP: 0402]
C7  value 0.1μF  Voltage: 16V  [CAP: 0402]
R5  value 22R  Tolerance: ±1%  [RES: 0402]
R6  value 22R  Tolerance: ±1%  [RES: 0402]
R7  value 10K  Tolerance: ±1%  [RES: 0402]
R8  value 10K  Tolerance: ±1%  [RES: 0402]
R9  value 1K  Tolerance: ±1%  [RES: 0402]
R10  value 22R  Tolerance: ±1%  [RES: 0402]
R11  value 10K  Tolerance: ±1%  [RES: 0402]
R12  value 5.6K  Tolerance: ±1%  [RES: 0402]
R13  value 1K  Tolerance: ±1%  [RES: 0402]
R14  value 470R  Tolerance: ±1%  [RES: 0402]
R15  value 22R  Tolerance: ±1%  [RES: 0402]
R16  value 22R  Tolerance: ±1%  [RES: 0402]
R17  value 10K  Tolerance: ±1%  [RES: 0402]
R18  value 5.6K  Tolerance: ±1%  [RES: 0402]
R19  value 10K  Tolerance: ±1%  [RES: 0402]
R20  value 22R  Tolerance: ±1%  [RES: 0402]
R21  value 470R  Tolerance: ±1%  [RES: 0402]
R22  value 22R  Tolerance: ±1%  [RES: 0402]
R23  value 10K  Tolerance: ±1%  [RES: 0402]
R24  value 10K  Tolerance: ±1%  [RES: 0402]
VD1  Voltage: 5.0V  PartNumber: PESD5V0L1UB  [DIODE: SOD523]
VD2  Voltage: 5.0V  PartNumber: PESD5V0L1UB  [DIODE: SOD523]
VD3  Voltage: 5.0V  PartNumber: PESD5V0L1UB  [DIODE: SOD523]
VD4  Voltage: 5.0V  PartNumber: PESD5V0L1UB  [DIODE: SOD523]
VD5  Voltage: 5.0V  PartNumber: PESD5V0L1UB  [DIODE: SOD523]
VD6  Voltage: 5.0V  PartNumber: PESD5V0L1UB  [DIODE: SOD523]
VD7  Voltage: 5.0V  PartNumber: PESD5V0L1UB  [DIODE: SOD523]
VD8  Voltage: 5.0V  PartNumber: PESD5V0L1UB  [DIODE: SOD523]
VD9  Voltage: 5.0V  PartNumber: PESD5V0L1UB  [DIODE: SOD523]
X1  CommentText: MCU UART  [CON: PLS-4]
X2  CommentText: M66 MAIN UART  [CON: PLS-3]
X3  CommentText: MCU UART  [CON: PLS-4]
X4  CommentText: M66 DEBUG UART  [CON: PLS-3]
X5  CommentText: TAMPER  [CON: PLS-2]
X6  CommentText: REED SWITCH  [CON: 282834-3]

### Ports
M66_RXD (bidir), M66_RXD_DBG (bidir), M66_TXD (bidir), M66_TXD_DBG (bidir), MCU_RX1 (bidir), MCU_TX1 (bidir), REED1 (bidir), REED2 (bidir), TAMPER (bidir)

### Nets
+3V3: C4.1 C5.1 C6.1 C7.1 R14.1 R21.1 X1.4 X3.4
GND: C4.2 C5.2 C6.2 C7.2 R7.2 R8.2 R11.1 R12.1 R17.1 R18.1 R19.1 R23.1 R24.1 VD1.1(A) VD2.1(A) VD3.1(A) VD4.1(A) VD5.1(A) VD6.1(A) VD7.1(A) VD8.1(A) VD9.1(A) X1.2 X2.2 X3.2 X4.2
NetD3_17: R9.2 R12.2 VD4.2(C) ; port M66_RXD
NetD3_18: R10.2 R11.2 VD3.2(C) ; port M66_TXD
NetD3_38: R13.2 R19.2 VD7.2(C) ; port M66_RXD_DBG
NetD3_39: R16.2 R18.2 VD6.2(C) ; port M66_TXD_DBG
NetD5_10: R22.2 R23.2 VD8.2(C) ; port REED1
NetD5_29: R20.2 R24.2 VD9.2(C) ; port REED2
NetD5_30: R6.2 R7.1 VD1.2(C) ; port MCU_TX1
NetD5_31: R5.2 R8.1 VD2.2(C) ; port MCU_RX1
NetD5_41: R15.2 R17.2 VD5.2(C) ; port TAMPER
NetR5_1: R5.1 X1.1 X3.1
NetR6_1: R6.1 X1.3 X3.3
NetR9_1: R9.1 X2.1
NetR10_1: R10.1 X2.3
NetR13_1: R13.1 X4.1
NetR14_2: R14.2 X5.1
NetR15_1: R15.1 X5.2
NetR16_1: R16.1 X4.3
NetR20_1: R20.1 X6.1
NetR21_2: R21.2 X6.2
NetR22_1: R22.1 X6.3

### Notes on the sheet
- CONNECTORS
- MCU UART
- GND
- MCU_RX
- +VCC
- MCU_TX
- M66_RX
- M66_TX
- M66_RX_DBG
- TAMPER
- M66_TX_DBG
- (near X6) REED SWITCH
- REED2
- REED1
- Author
- Manufacturer
- Date
- Page
- Total pages
- Size page
- A3
- Materials
- (in symbol KLS2-308V-2.54-03P-4S) Цепь; Конт.
- (in symbol PLS-2) Цепь; Конт.
- (in symbol PLS-3) Цепь; Конт.
- (in symbol PLS-4) Цепь; Конт.

### Library data of the parts
C4-C7 = Ceramic_0402: as C20 on sheet MCU; Package: 0402; HelpURL: https://www.digikey.com/product-detail/en/yageo/CC0402KRX7R7BB104/311-1338-1-ND/2103122; Temperature: -55...+125°C; TypeCapacitor: Ceramic capacitor; Tolerance: ±10%; TypeDielectric: X7R
R5 R6 R10 R15 R16 R20 R22 = Resistor_0402: as R52 on sheet MCU; Package: 0402; HelpURL: https://www.digikey.com/en/products/detail/yageo/RC0402FR-0722RL/726562; Temperature: -55...+125°C; Power: 0.063W
R7 R8 R11 R17 R19 R23 R24 = Resistor_0402: as R56 on sheet MCU; Package: 0402; HelpURL: https://www.digikey.com/en/products/detail/yageo/RC0402FR-0710KL/726523; Temperature: -55...+125°C; Power: 0.063W
R9 R13 = Resistor_0402: 1 kOhms ±1% 0.063W, 1/16W Chip Resistor 0402 (1005 Metric) Moisture Resistant Thick Film; Manufacturer: Yageo; PartNumber: RC0402FR-071KP; ValueManufacturerPartNumber: Resistor film, 1K, ±1%, 0402, 0.063W, -55...+125°C; TypeResistor: Resistor film; Package: 0402; HelpURL: https://www.digikey.com/en/products/detail/yageo/RC0402FR-071KP/4935269; Temperature: -55...+125°C; Power: 0.063W
R12 R18 = Resistor_0402: 5.6 kOhms ±1% 0.063W, 1/16W Chip Resistor 0402 (1005 Metric) Moisture Resistant Thick Film; Manufacturer: Yageo; PartNumber: RC0402FR-075K6L; ValueManufacturerPartNumber: Resistor film, 5.6K, ±1%, 0402, 0.063W, -55...+125°C; TypeResistor: Resistor film; Package: 0402; HelpURL: https://www.digikey.com/en/products/detail/yageo/RC0402FR-075K6L/2827590; Temperature: -55...+125°C; Power: 0.063W
R14 R21 = Resistor_0402: 220 Ohms ±1% 0.063W, 1/16W Chip Resistor 0402 (1005 Metric) Moisture Resistant Thick Film; Manufacturer: Yageo; PartNumber: RC0402FR-07470RL; ValueManufacturerPartNumber: Resistor film, 470R, ±1%, 0402, 0.063W, -55...+125°C; TypeResistor: Resistor film; Package: 0402; HelpURL: https://www.digikey.com/en/products/detail/yageo/RC0402FR-07470RL/726619; Temperature: -55...+125°C; Power: 0.063W
VD1-VD9 = TVS_single: as VD15 on sheet MCU; Package: SOD-523; HelpURL: https://www.digikey.com/en/products/detail/nexperia-usa-inc/PESD5V0L1UB115/2092297; ValueManufacturerPartNumber: =TypeDiode+', '+Voltage+', '+Current+', '+VoltageDrop+', '+RecoveryTime+', '+Package+', '+Temperature; Temperature: -55...+150°C; Current: 3.5A
X1 X3 = PLS-4: Pin Header 4 pin Straight, 2.54mm Through Hole.; Manufacturer: KLS; ValueManufacturerPartNumber: Connector, 4pin, 2.54mm, 500VAC, 3A; PartNumber: KLS1-207-1-02-S; TypeConnector: Connector; VoltageMax: 500VAC; CurrentMax: 3A; Multichannel: 4pin; HelpURL: https://www.klselectronic.com/kls1-207-2-54mm-pitch-male-pin-header-connectors; Pitch: 2.54mm
X2 X4 = PLS-3: Pin Header 3 pin Straight, 2.54mm Through Hole.; Manufacturer: KLS; ValueManufacturerPartNumber: Connector, 3pin, 2.54mm, 500VAC, 3A; PartNumber: KLS1-207-1-03-S; TypeConnector: Connector; VoltageMax: 500VAC; CurrentMax: 3A; Multichannel: 3pin; HelpURL: https://www.klselectronic.com/kls1-207-2-54mm-pitch-male-pin-header-connectors; Pitch: 2.54mm
X5 = PLS-2: Pin Header 2 pin Straight, 2.54mm Through Hole.; Manufacturer: KLS; ValueManufacturerPartNumber: Connector, 2pin, 2.54mm, 500VAC, 3A; PartNumber: KLS1-207-1-02-S; TypeConnector: Connector; VoltageMax: 500VAC; CurrentMax: 3A; Multichannel: 2pin; HelpURL: https://www.klselectronic.com/kls1-207-2-54mm-pitch-male-pin-header-connectors; Pitch: 2.54mm
X6 = KLS2-308V-2.54-03P-4S: 3 Position Wire to Board Terminal Block Horizontal with Board 0.100" (2.54mm) Through Hole; Manufacturer: KLS; TypeConnector: Block Terminal; VoltageMax: 500VAC; CurrentMax: 15A; Multichannel: 3pin; HelpURL: http://www.klsele.com/products/Terminal-blocks/560/278.html; ValueManufacturerPartNumber: =TypeConnector+', '+Multichannel+', '+Pitch+', '+VoltageMax+', '+CurrentMax; PartNumber: KLS2-308V-2.54-03P-4S

## Sheet M66_GPRS.SchDoc
size 420 x 297 mm
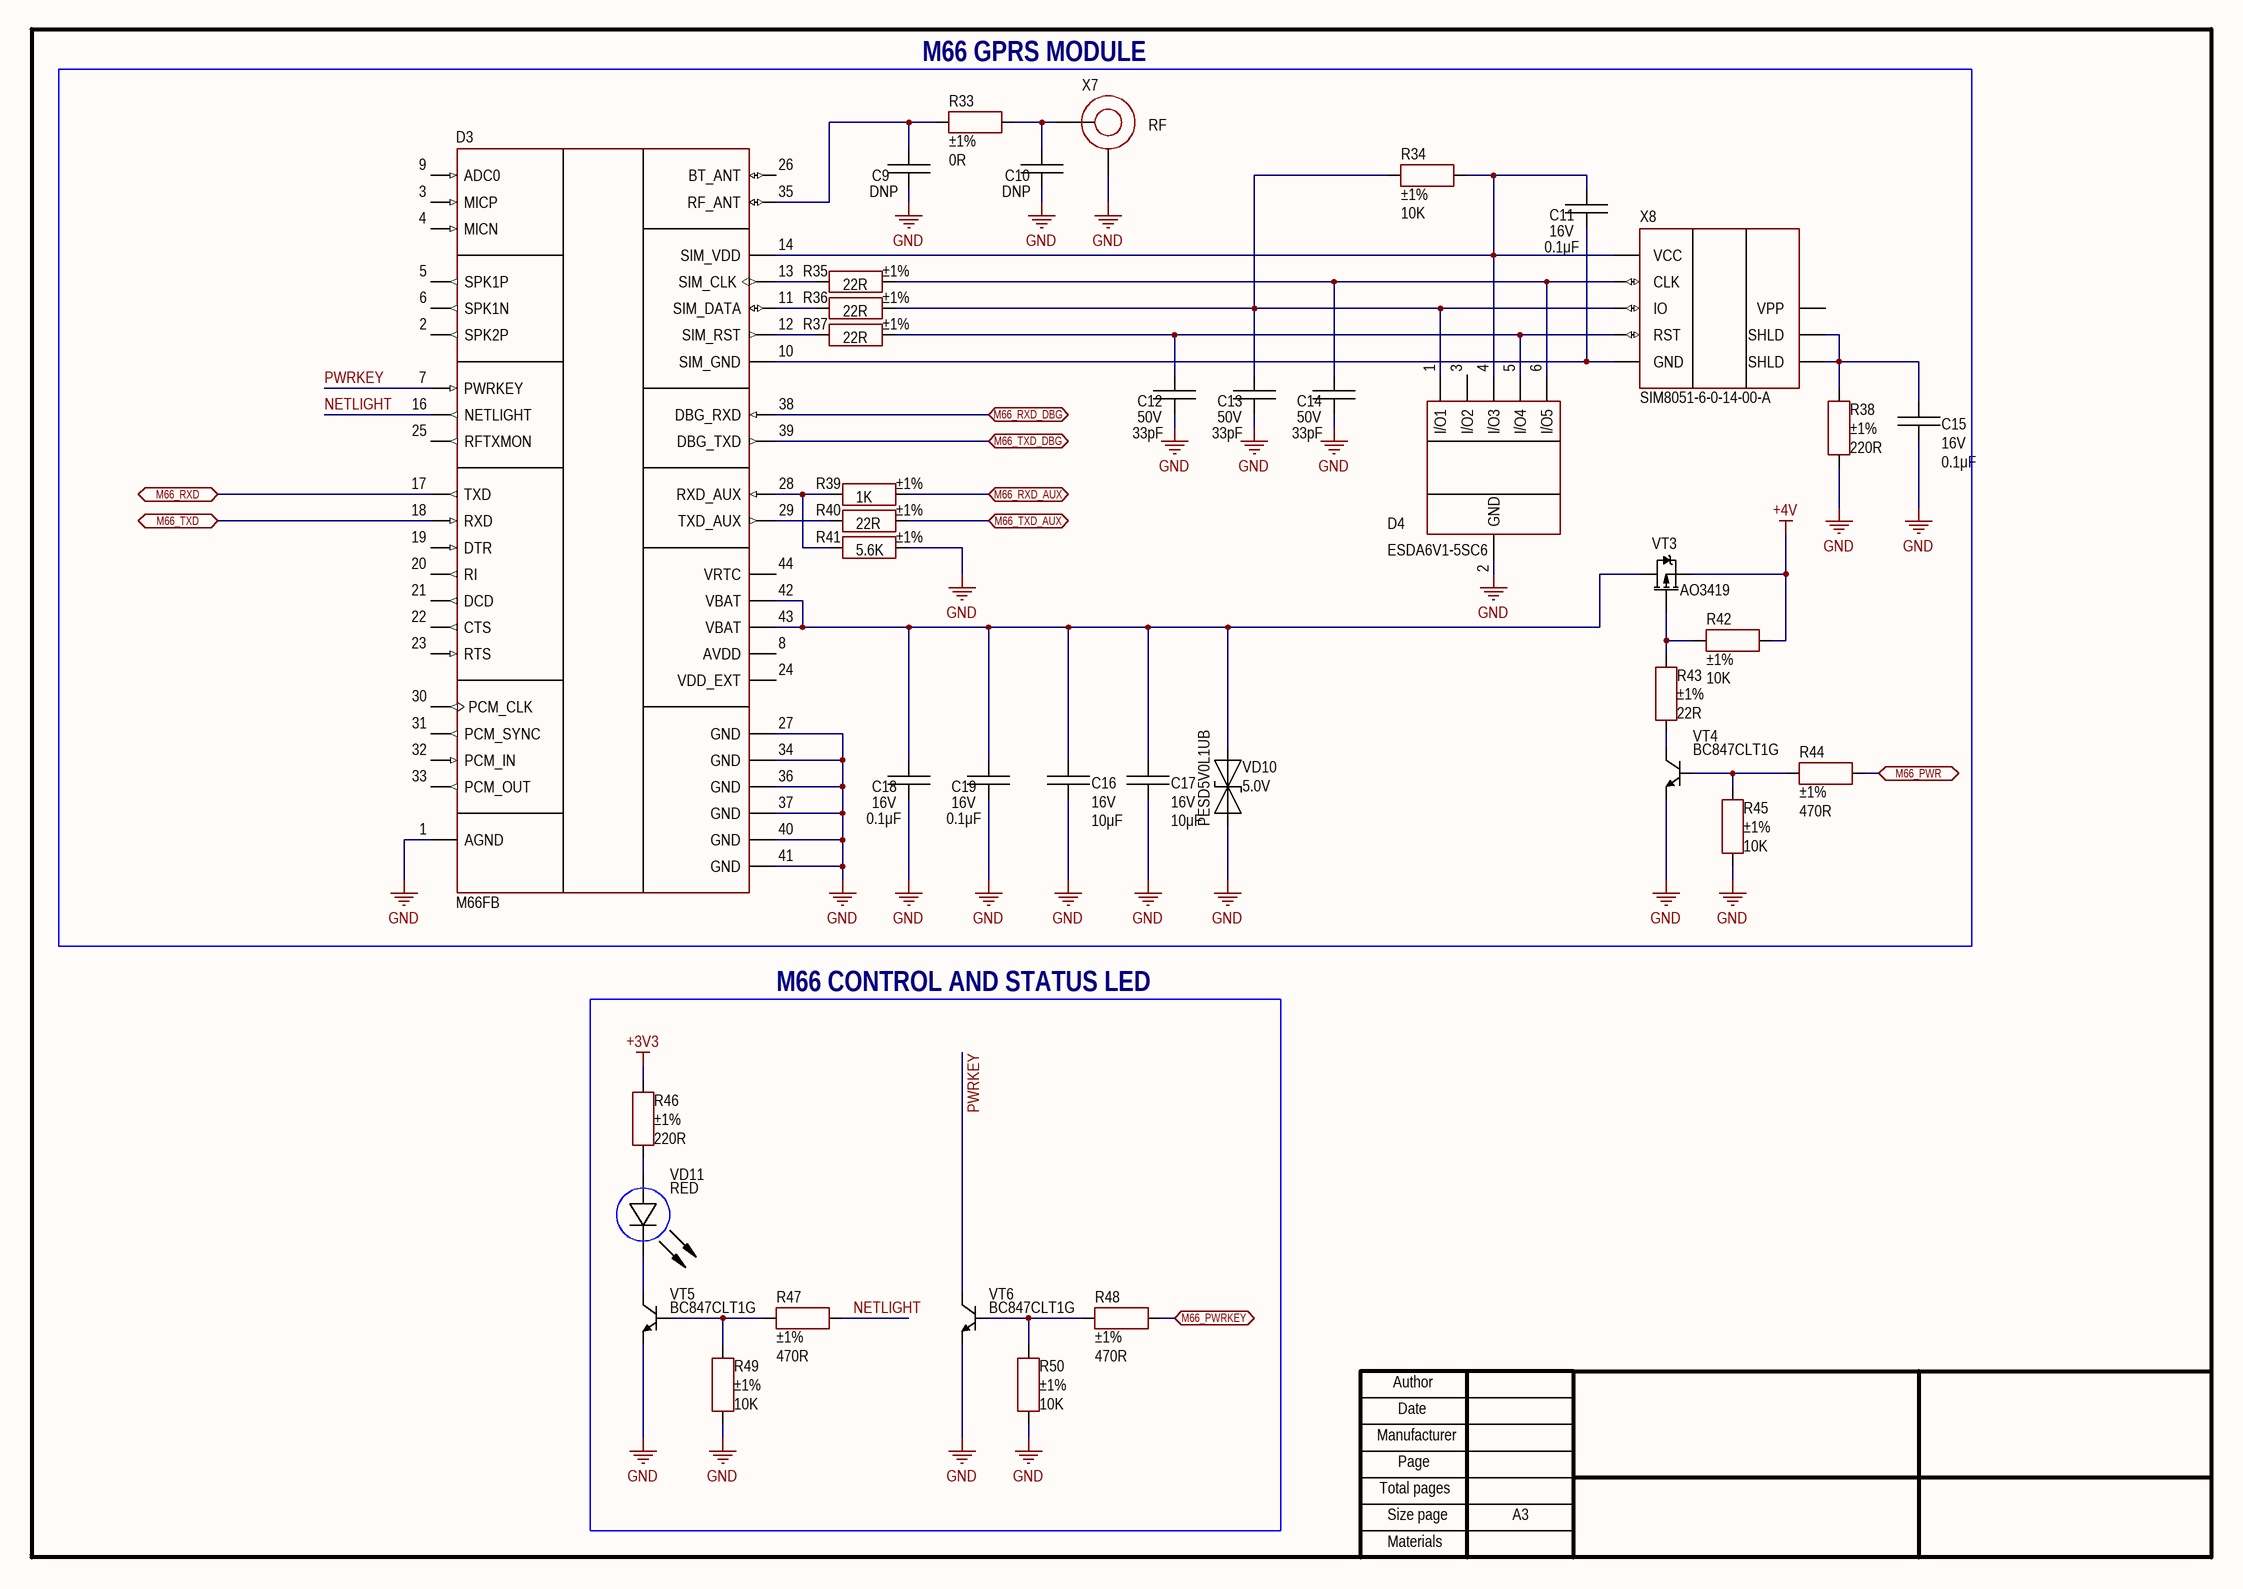
[diagram p7: M66_GPRS.SchDoc]

### Parts
C9  value DNP  [CAP: 0402]
C10  value DNP  [CAP: 0402]
C11  value 0.1μF  Voltage: 16V  [CAP: 0402]
C12  value 33pF  Voltage: 50V  [CAP: 0402]
C13  value 33pF  Voltage: 50V  [CAP: 0402]
C14  value 33pF  Voltage: 50V  [CAP: 0402]
C15  value 0.1μF  Voltage: 16V  [CAP: 0402]
C16  value 10μF  Voltage: 16V  [CAP: 0805]
C17  value 10μF  Voltage: 16V  [CAP: 0805]
C18  value 0.1μF  Voltage: 16V  [CAP: 0402]
C19  value 0.1μF  Voltage: 16V  [CAP: 0402]
D3  (no value)  [MOD: M66]
D4  (no value)  [SOT23-6]
R33  value 0R  Tolerance: ±1%  [RES: 0402]
R34  value 10K  Tolerance: ±1%  [RES: 0402]
R35  value 22R  Tolerance: ±1%  [RES: 0402]
R36  value 22R  Tolerance: ±1%  [RES: 0402]
R37  value 22R  Tolerance: ±1%  [RES: 0402]
R38  value 220R  Tolerance: ±1%  [RES: 0402]
R39  value 1K  Tolerance: ±1%  [RES: 0402]
R40  value 22R  Tolerance: ±1%  [RES: 0402]
R41  value 5.6K  Tolerance: ±1%  [RES: 0402]
R42  value 10K  Tolerance: ±1%  [RES: 0402]
R43  value 22R  Tolerance: ±1%  [RES: 0402]
R44  value 470R  Tolerance: ±1%  [RES: 0402]
R45  value 10K  Tolerance: ±1%  [RES: 0402]
R46  value 220R  Tolerance: ±1%  [RES: 0402]
R47  value 470R  Tolerance: ±1%  [RES: 0402]
R48  value 470R  Tolerance: ±1%  [RES: 0402]
R49  value 10K  Tolerance: ±1%  [RES: 0402]
R50  value 10K  Tolerance: ±1%  [RES: 0402]
VD10  Voltage: 5.0V  PartNumber: PESD5V0L1UB  [DIODE: SOD523]
VD11  Color: RED  [LED: 0805R]
VT3  PartNumber: AO3419  [SOT23]
VT4  PartNumber: BC847CLT1G  [SOT23]
VT5  PartNumber: BC847CLT1G  [SOT23]
VT6  PartNumber: BC847CLT1G  [SOT23]
X7  CommentText: RF  [CON: u.Fl]
X8  (no value)  [CON: SIM8051-6-0-14-00]

### Blocks framed on the sheet
M66 GPRS MODULE: C9-C19 D3 D4 R33-R45 VD10 VT3 VT4 X7 X8
M66 CONTROL AND STATUS LED: R46-R50 VD11 VT5 VT6

### Ports
M66_PWR (bidir), M66_PWRKEY (bidir), M66_RXD (bidir), M66_RXD_AUX (bidir), M66_RXD_DBG (bidir), M66_TXD (bidir), M66_TXD_AUX (bidir), M66_TXD_DBG (bidir)

### Nets
+3V3: R46.2
+4V: R42.1 VT3.2(S)
GND: C9.2 C10.2 C12.2 C13.2 C14.2 C15.2 C16.1 C17.1 C18.2 C19.2 D3.1(AGND) D3.27(GND) D3.34(GND) D3.36(GND) D3.37(GND) D3.40(GND) D3.41(GND) D4.2(GND) R38.1 R41.2 R45.1 R49.1 R50.1 VD10.1(A) VT4.2(E) VT5.2(E) VT6.2(E) X7.2
NETLIGHT: D3.16(NETLIGHT) R47.1
PWRKEY: D3.7(PWRKEY) VT6.3(C)
NetC9_1: C9.1 D3.35(RF_ANT) R33.2
NetC10_1: C10.1 R33.1 X7.1
NetC11_1: C11.1 D3.14(SIM_VDD) D4.4(I/O3) R34.1 X8.C1(VCC)
NetC11_2: C11.2 D3.10(SIM_GND) X8.C5(GND)
NetC12_1: C12.1 D4.5(I/O4) R37.2 X8.C2(RST)
NetC13_1: C13.1 D4.1(I/O1) R34.2 R36.2 X8.C7(IO)
NetC14_1: C14.1 D4.6(I/O5) R35.2 X8.C3(CLK)
NetC15_1: C15.1 R38.2 X8.C4(SHLD) X8.C8(SHLD)
NetC16_2: C16.2 C17.2 C18.1 C19.1 D3.42(VBAT) D3.43(VBAT) VD10.2(C) VT3.3(D)
NetD3_11: D3.11(SIM_DATA) R36.1
NetD3_12: D3.12(SIM_RST) R37.1
NetD3_13: D3.13(SIM_CLK) R35.1
NetD3_17: D3.17(TXD) ; port M66_RXD
NetD3_18: D3.18(RXD) ; port M66_TXD
NetD3_28: D3.28(RXD_AUX) R39.1 R41.1
NetD3_29: D3.29(TXD_AUX) R40.1
NetD3_38: D3.38(DBG_RXD) ; port M66_RXD_DBG
NetD3_39: D3.39(DBG_TXD) ; port M66_TXD_DBG
NetD5_12: R39.2 ; port M66_RXD_AUX
NetD5_13: R40.2 ; port M66_TXD_AUX
NetD5_21: R48.2 ; port M66_PWRKEY
NetD5_22: R44.2 ; port M66_PWR
NetR42_2: R42.2 R43.2 VT3.1(G)
NetR43_1: R43.1 VT4.3(C)
NetR44_1: R44.1 R45.2 VT4.1(B)
NetR46_1: R46.1 VD11.1(A)
NetR47_2: R47.2 R49.2 VT5.1(B)
NetR48_1: R48.1 R50.2 VT6.1(B)
NetVD11_2: VD11.2(C) VT5.3(C)

Not connected (* = marked no-connect by the designer): D3 2(SPK2P) 3(MICP) 4(MICN) 5(SPK1P) 6(SPK1N) 8(AVDD) 9(ADC0) 19(DTR) 20(RI) 21(DCD) 22(CTS) 23(RTS) 24(VDD_EXT) 25(RFTXMON) 26(BT_ANT) 30(PCM_CLK) 31(PCM_SYNC) 32(PCM_IN) 33(PCM_OUT) 44(VRTC); D4 3(I/O2); X8 C6(VPP)

### Notes on the sheet
- Author
- Manufacturer
- Date
- Page
- Total pages
- Size page
- A3
- Materials

### Library data of the parts
C9 C10 = Ceramic_0402: DNP; PartNumber: DNP
C11 C15 C18 C19 = Ceramic_0402: as C20 on sheet MCU; Package: 0402; HelpURL: https://www.digikey.com/product-detail/en/yageo/CC0402KRX7R7BB104/311-1338-1-ND/2103122; Temperature: -55...+125°C; TypeCapacitor: Ceramic capacitor; Tolerance: ±10%; TypeDielectric: X7R
C12-C14 = Ceramic_0402: 33 pF ±5% 50V Ceramic Capacitor C0G, NP0 0402 (1005 Metric); Manufacturer: Yageo; PartNumber: CC0402JRNPO9BN330; ValueManufacturerPartNumber: Ceramic capacitor, 33pF, NP0, ±10%, 50V, 0402, -55...+125°C; Tolerance: ±10%; Package: 0402; HelpURL: https://www.digikey.com/en/products/detail/yageo/CC0402JRNPO9BN330/302754; Temperature: -55...+125°C; TypeCapacitor: Ceramic capacitor; TypeDielectric: NP0
C16 C17 = Ceramic_0805: as C22 on sheet MCU; Package: 0805; HelpURL: https://www.digikey.com/en/products/detail/yageo/CC0805MKX7R7BB106/7164392; Temperature: -55...+125°C; TypeCapacitor: Ceramic capacitor; TypeDielectric: X7R
D3 = M66FB: GPRS Modem; Manufacturer: Quectel; Supply: 3.3...4.6V; Frequency: 2.4GHz; TypeProtocol: GPRS 850/ 900/ 1800/ 1900MHz + Bluetooth; HelpURL: https://www.digikey.com/en/products/detail/quectel/M66FB-03-STD/13278058; Package: 44-LGA; ComponentType: IC 2G RF transceiver; ValueManufacturerPartNumber: =ComponentType+', '+TypeProtocol+', '+Frequency+', '+CoreSize+', '+CoreProcessor+', '+MemoryROM+', '+MemoryRAM+', '+Supply+', '+Temperature+', '+Package; Temperature: -40...+85°C; PartNumber: M66FB
D4 = ESDA6V1-5SC6: 6.1V 100W TVS Array Surface Mount SOT-23-6; Manufacturer: STMicroelectronics; Current: 5A peak; Package: SOT-23-6; HelpURL: https://www.digikey.com/en/products/detail/stmicroelectronics/ESDA6V1-5SC6/1037983; ValueManufacturerPartNumber: =TypeDiode+', '+Voltage+', '+Current+', '+VoltageDrop+', '+RecoveryTime+', '+Package+', '+Temperature; Temperature: -40...+125°C; TypeDiode: TVS array; VoltageDrop: 6.1V; PartNumber: ESDA6V1-5SC6
R33 = Resistor_0402: 0 Ohms Jumper 0.063W, 1/16W Chip Resistor 0402 (1005 Metric) Moisture Resistant Thick Film; Manufacturer: Yageo; PartNumber: RC0402JR-070RL; ValueManufacturerPartNumber: Resistor film, 0R, ±1%, 0402, 0.063W, -55...+125°C; TypeResistor: Resistor film; Package: 0402; HelpURL: https://www.digikey.com/en/products/detail/yageo/RC0402JR-070RL/726406; Temperature: -55...+125°C; Power: 0.063W
R34 R42 R45 R49 R50 = Resistor_0402: as R56 on sheet MCU; Package: 0402; HelpURL: https://www.digikey.com/en/products/detail/yageo/RC0402FR-0710KL/726523; Temperature: -55...+125°C; Power: 0.063W
R35-R37 R40 R43 = Resistor_0402: as R52 on sheet MCU; Package: 0402; HelpURL: https://www.digikey.com/en/products/detail/yageo/RC0402FR-0722RL/726562; Temperature: -55...+125°C; Power: 0.063W
R38 R46 = Resistor_0402: as R54 on sheet MCU; Package: 0402; HelpURL: https://www.digikey.com/en/products/detail/yageo/RC0402FR-07220RL/726565; Temperature: -55...+125°C; Power: 0.063W
R39 = Resistor_0402: as R9 on sheet Connectors; Package: 0402; HelpURL: https://www.digikey.com/en/products/detail/yageo/RC0402FR-071KP/4935269; Temperature: -55...+125°C; Power: 0.063W
R41 = Resistor_0402: as R12 on sheet Connectors; Package: 0402; HelpURL: https://www.digikey.com/en/products/detail/yageo/RC0402FR-075K6L/2827590; Temperature: -55...+125°C; Power: 0.063W
R44 R47 R48 = Resistor_0402: as R31 on sheet Flash; Package: 0402; HelpURL: https://www.digikey.com/en/products/detail/yageo/RC0402FR-07470RL/726619; Temperature: -55...+125°C; Power: 0.063W
VD10 = TVS_single: as VD15 on sheet MCU; Package: SOD-523; HelpURL: https://www.digikey.com/en/products/detail/nexperia-usa-inc/PESD5V0L1UB115/2092297; ValueManufacturerPartNumber: =TypeDiode+', '+Voltage+', '+Current+', '+VoltageDrop+', '+RecoveryTime+', '+Package+', '+Temperature; Temperature: -55...+150°C; Current: 3.5A
VD11 = LED_single: as VD12 on sheet MCU; Package: 0805; HelpURL: https://www.digikey.com/en/products/detail/kingbright/APT2012LSECK-J3-PRV/5177436; Temperature: -55...+150°C; TypeDiode: LED; VoltageDrop: 1.8V; ColorParameter: RED
VT3 = MOSFET_P_132: as VT1 on sheet Flash; Package: SOT-23-3; HelpURL: https://www.digikey.com/product-detail/en/infineon-technologies/BSC340N08NS3GATMA1/BSC340N08NS3GATMA1TR-ND/2080655; Temperature: -55...+150°C; CurrentDS: 3.5A
VT4-VT6 = BJT_NPN_132: as VT2 on sheet Flash; Package: SOT-23; HelpURL: https://www.digikey.com/product-detail/en/on-semiconductor/BC847CLT1G/BC847CLT1GOSCT-ND/917836; Temperature: -55...+125°C; Frequency: 100MHz
X7 = Connector_uFL: U.FL (UMCC), AMC Connector Jack, Male Pin 50Ohm Surface Mount Solder; Manufacturer: Amphenol RF; ValueManufacturerPartNumber: Connector u.FL, 50 Ohm, 6GHz; PartNumber: A-1JB; TypeConnector: Connector u.FL; Frequency: 6GHz; HelpURL: https://www.digikey.com/en/products/detail/amphenol-rf/A-1JB/1012540; Impedance: 50 Ohm
X8 = SIM8051-6-0-14-00-A: 6 Position Card Connector NANO SIM Surface Mount, Right Angle Gold; Manufacturer: GCT; HelpURL: https://www.digikey.com/en/products/detail/gct/SIM8051-6-0-14-00-A/10649873; ValueManufacturerPartNumber: =TypeConnector+', '+Multichannel+', '+Pitch+', '+VoltageMax+', '+CurrentMax; TypeConnector: Nano SIM; PartNumber: SIM8051-6-0-14-00-A; CommentText: SIM8051-6-0-14-00-A

## Nets that join several sheets
+3V3: MCU (14 pins), Accelerometer (5 pins), Flash (R27.2 VT1.2), TempSensor (C41.2 D8.5 R69.2 R70.2), Power (C33.1 C35.2 D6.5), Connectors (8 pins), M66_GPRS (R46.2)
+4V: Power (6 pins), M66_GPRS (R42.1 VT3.2)
+VBAT: MCU (R51.2), Power (8 pins)
GND: MCU (25 pins), Accelerometer (5 pins), Flash (C8.1 D2.4 R32.1 VT2.2), TempSensor (C41.1 D8.2), Power (16 pins), Connectors (26 pins), M66_GPRS (28 pins)
NetD1_5: MCU (D5.20), Accelerometer (D1.5)
NetD3_17: Connectors (R9.2 R12.2 VD4.2), M66_GPRS (D3.17)
NetD3_18: Connectors (R10.2 R11.2 VD3.2), M66_GPRS (D3.18)
NetD3_38: Connectors (R13.2 R19.2 VD7.2), M66_GPRS (D3.38)
NetD3_39: Connectors (R16.2 R18.2 VD6.2), M66_GPRS (D3.39)
NetD5_10: MCU (D5.10), Connectors (R22.2 R23.2 VD8.2)
NetD5_12: MCU (D5.12), M66_GPRS (R39.2)
NetD5_13: MCU (D5.13), M66_GPRS (R40.2)
NetD5_14: MCU (D5.14), Accelerometer (R4.1)
NetD5_15: MCU (D5.15), Accelerometer (R3.1)
NetD5_16: MCU (D5.16), Accelerometer (R1.1)
NetD5_17: MCU (D5.17), Accelerometer (R2.1)
NetD5_19: MCU (D5.19), Power (R66.2)
NetD5_21: MCU (D5.21), M66_GPRS (R48.2)
NetD5_22: MCU (D5.22), M66_GPRS (R44.2)
NetD5_25: MCU (D5.25), Flash (R29.1)
NetD5_26: MCU (D5.26), Flash (R28.1)
NetD5_27: MCU (D5.27), Flash (R26.1)
NetD5_28: MCU (D5.28), Flash (R25.1)
NetD5_29: MCU (D5.29), Connectors (R20.2 R24.2 VD9.2)
NetD5_30: MCU (D5.30), Connectors (R6.2 R7.1 VD1.2)
NetD5_31: MCU (D5.31), Connectors (R5.2 R8.1 VD2.2)
NetD5_41: MCU (D5.41), Connectors (R15.2 R17.2 VD5.2)
NetD5_42: MCU (D5.42), TempSensor (D8.6 R70.1)
NetD5_43: MCU (D5.43), TempSensor (D8.1 R69.1)
NetD5_45: MCU (D5.45), Flash (R31.2)
NetD5_46: MCU (D5.46), Power (D7.2 R64.2)